# EAGLE design XMICRO-CF V1.0 (EAGLE 6.3)
PROJECT_NAME: XMICRO-CF; PROJECT_REVISION: 1.0

## Sheet 1 of 5: Bus Interface
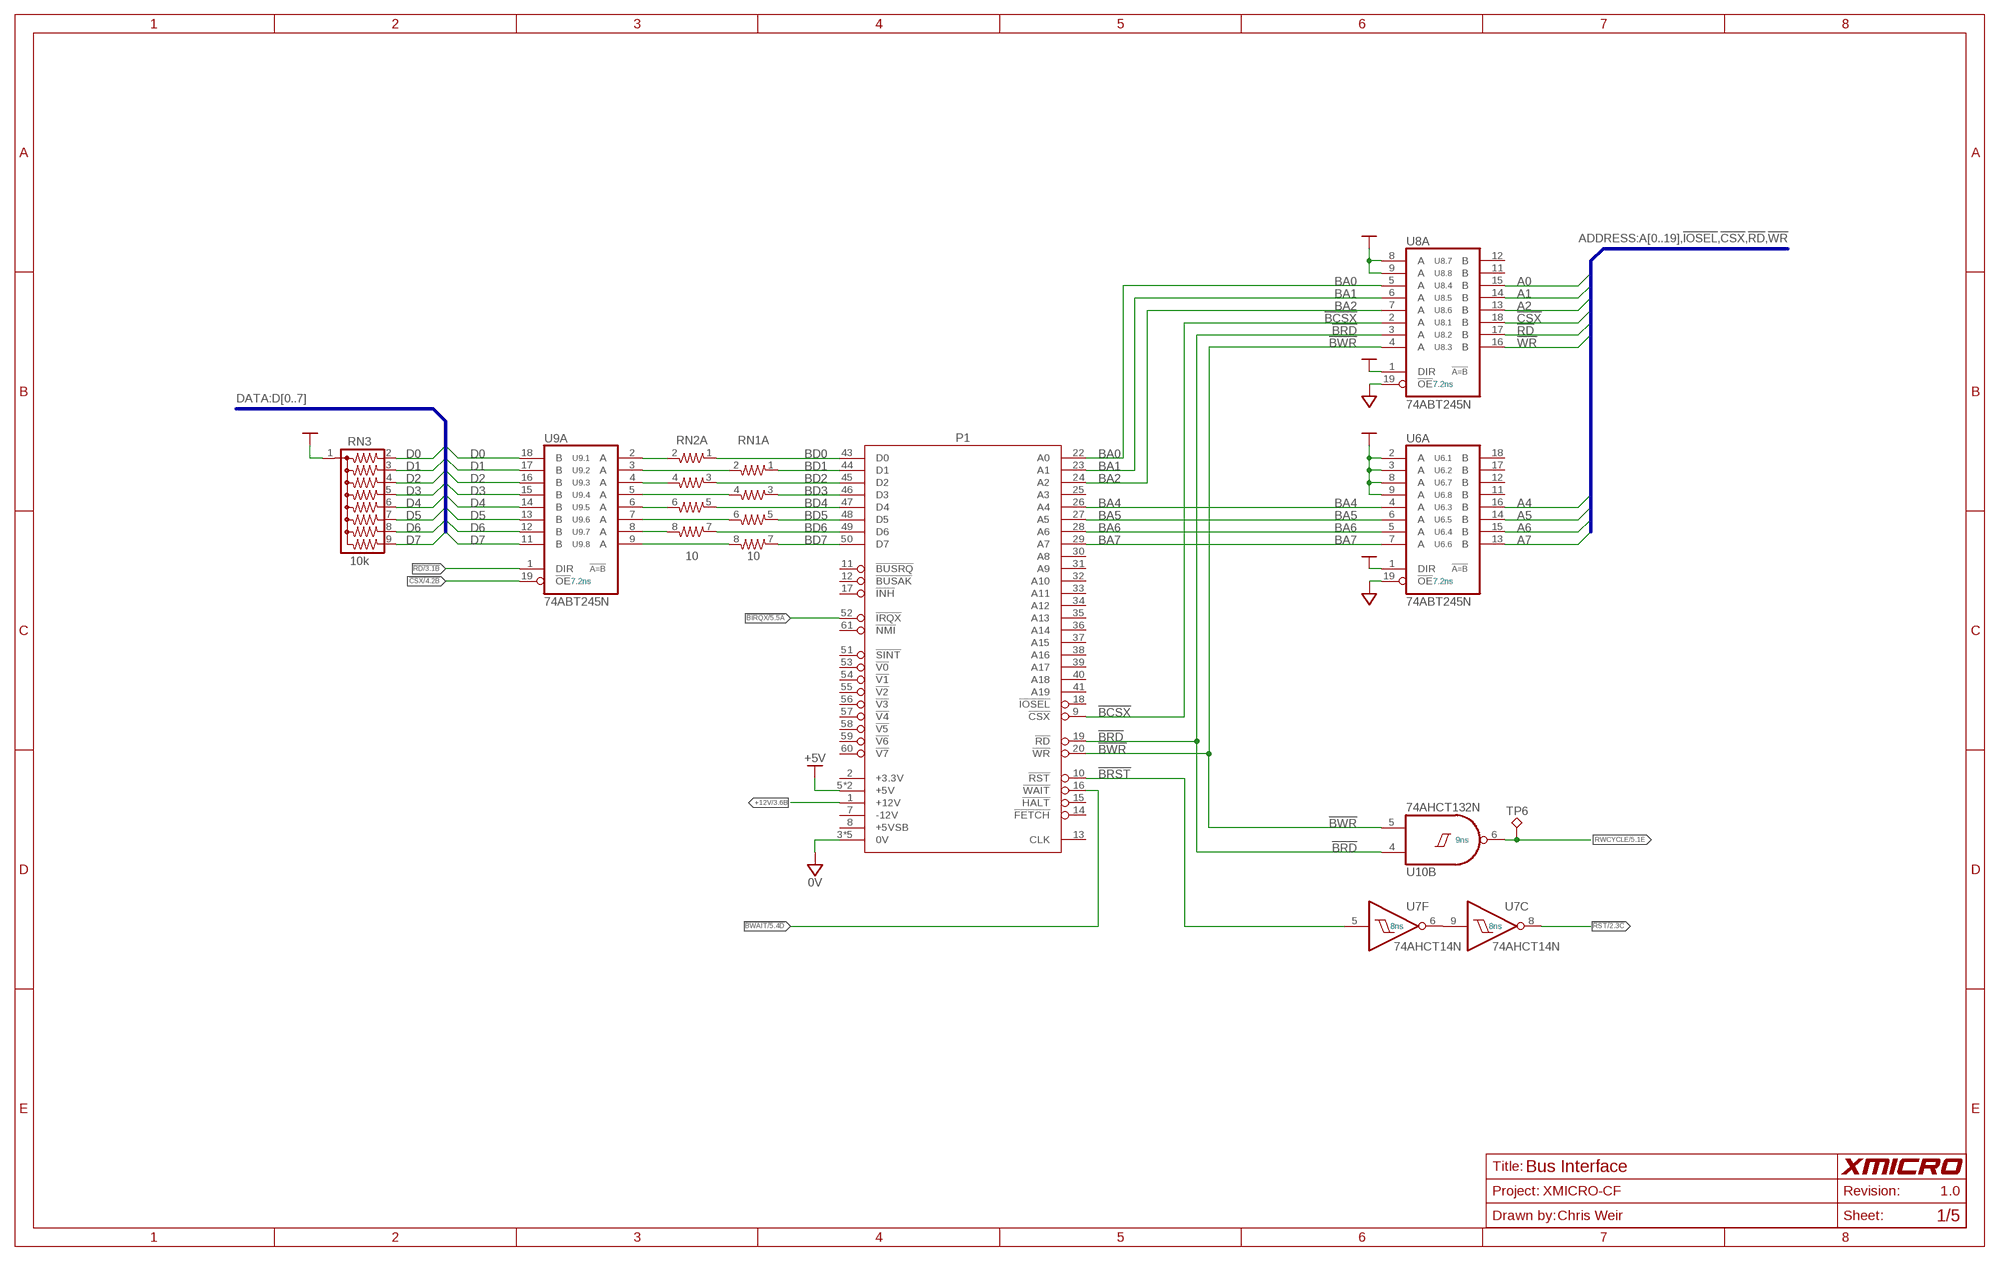
[diagram p0: schematic, sheet 1]
FRAME1 (11X17): DRAWN_BY: Chris Weir; SHEET_TITLE: Bus Interface

### Parts
P1  XMICRO-BUS-EDGE  [EDGE62M]
RN1  10  E4R  [SIL8]
RN2  10  E4R  [SIL8]
RN3  10k  G08R  [SIL9]
TP6  TP-040  [TP-040]
U6  74ABT245N  74ABT245-SN  [DIL20]
U7  74AHCT14N  [DIL14]
U8  74ABT245N  74ABT245-SN  [DIL20]
U9  74ABT245N  74ABT245-SN  [DIL20]
U10  74AHCT132N  [DIL14]

### Nets
0V [0V]: P1.3(0V) P1.4(0V) P1.21(0V) P1.42(0V) P1.62(0V) U6.19(A:!OE) U8.19(A:!OE) ; also sheet 2,3,4,5
!BCSX: P1.9(!CSX) U8.2(.1:A)
!BIRQX: P1.52(!IRQX) ; also sheet 5
!BRD: P1.19(!RD) U8.3(.2:A) U10.4(B:I0)
!BRST: P1.10(!RST) U7.5(F:I)
!BWAIT: P1.16(!WAIT) ; also sheet 5
!BWR: P1.20(!WR) U8.4(.3:A) U10.5(B:I1)
!CSX: U8.18(.1:B) U9.19(A:!OE) ; also sheet 4,5
!RD: U8.17(.2:B) U9.1(A:DIR) ; also sheet 2,3,4
!RST: U7.8(C:O) ; also sheet 2,5
!WR: U8.16(.3:B) ; also sheet 2,3,4
+5V [SUPPLY]: P1.5(+5V) P1.6(+5V) RN3.1 U6.1(A:DIR) U6.2(.1:A) U6.3(.2:A) U6.8(.7:A) U6.9(.8:A) U8.1(A:DIR) U8.8(.7:A) U8.9(.8:A) ; also sheet 2,3,4,5
+12V [SUPPLY]: P1.1(+12V) ; also sheet 3
A0: U8.15(.4:B) ; also sheet 2,3,4
A1: U8.14(.5:B) ; also sheet 2
A2: U8.13(.6:B) ; also sheet 2
A4: U6.16(.3:B) ; also sheet 4
A5: U6.14(.5:B) ; also sheet 4
A6: U6.15(.4:B) ; also sheet 4
A7: U6.13(.6:B) ; also sheet 4
BA0: P1.22(A0) U8.5(.4:A)
BA1: P1.23(A1) U8.6(.5:A)
BA2: P1.24(A2) U8.7(.6:A)
BA4: P1.26(A4) U6.4(.3:A)
BA5: P1.27(A5) U6.6(.5:A)
BA6: P1.28(A6) U6.5(.4:A)
BA7: P1.29(A7) U6.7(.6:A)
BD0: P1.43(D0) RN2.1
BD1: P1.44(D1) RN1.1
BD2: P1.45(D2) RN2.3
BD3: P1.46(D3) RN1.3
BD4: P1.47(D4) RN2.5
BD5: P1.48(D5) RN1.5
BD6: P1.49(D6) RN2.7
BD7: P1.50(D7) RN1.7
D0: RN3.2 U9.18(.1:B) ; also sheet 2,3,4
D1: RN3.3 U9.17(.2:B) ; also sheet 2,3,4
D2: RN3.4 U9.16(.3:B) ; also sheet 2,3,4
D3: RN3.5 U9.15(.4:B) ; also sheet 2,3,4,5
D4: RN3.6 U9.14(.5:B) ; also sheet 2,3,4
D5: RN3.7 U9.13(.6:B) ; also sheet 2,3,4
D6: RN3.8 U9.12(.7:B) ; also sheet 2,3,4
D7: RN3.9 U9.11(.8:B) ; also sheet 2,3,4
N$12: U7.6(F:O) U7.9(C:I)
N$37: RN2.2 U9.2(.1:A)
N$38: RN1.2 U9.3(.2:A)
N$39: RN2.4 U9.4(.3:A)
N$40: RN1.4 U9.5(.4:A)
N$41: RN2.6 U9.6(.5:A)
N$42: RN1.6 U9.7(.6:A)
N$43: RN2.8 U9.8(.7:A)
N$44: RN1.8 U9.9(.8:A)
RWCYCLE: TP6.1 U10.6(B:O) ; also sheet 5
Unconnected: P1.2(+3.3V) P1.7(-12V) P1.8(+5VSB) P1.11(!BUSRQ) P1.12(!BUSAK) P1.13(CLK) P1.14(!FETCH) P1.15(!HALT) P1.17(!INH) P1.18(!IOSEL) P1.25(A3) P1.30(A8) P1.31(A9) P1.32(A10) P1.33(A11) P1.34(A12) P1.35(A13) P1.36(A14) P1.37(A15) P1.38(A16) P1.39(A17) P1.40(A18) P1.41(A19) P1.51(!SINT) P1.53(!V0) P1.54(!V1) P1.55(!V2) P1.56(!V3) P1.57(!V4) P1.58(!V5) P1.59(!V6) P1.60(!V7) P1.61(!NMI) U6.11(.8:B) U6.12(.7:B) U6.17(.2:B) U6.18(.1:B) U8.11(.8:B) U8.12(.7:B)

### Buses
ADDRESS:A[0..19],!IOSEL,!CSX,!RD,!WR
DATA:D[0..7]

## Sheet 2 of 5: CompactFlash Interface
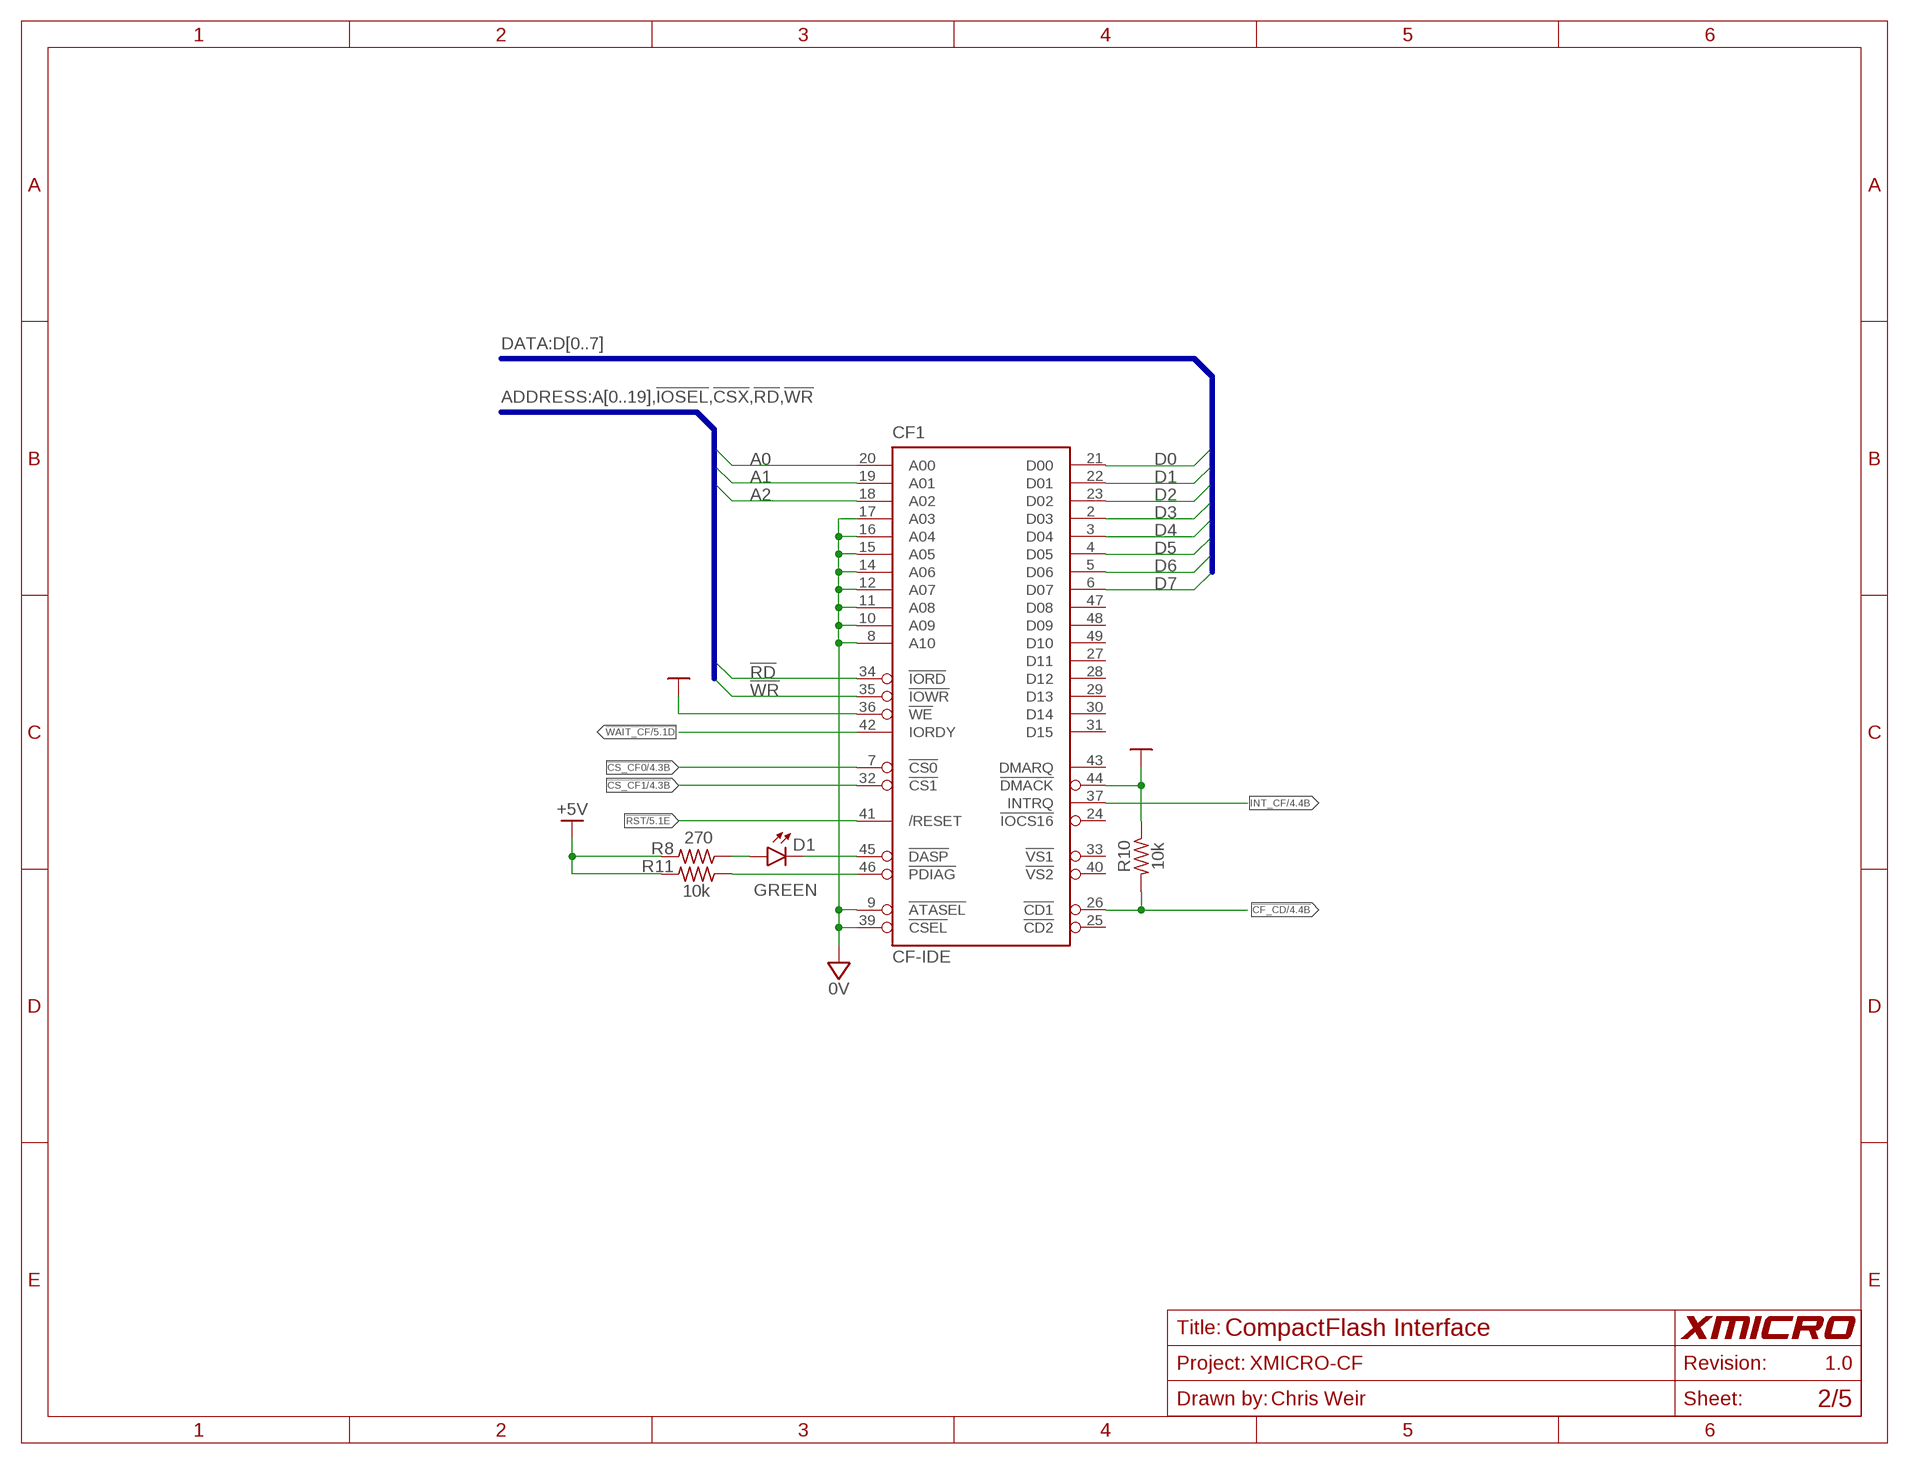
[diagram p1: schematic, sheet 2]
FRAME4 (LETTER): DRAWN_BY: Chris Weir; SHEET_TITLE: CompactFlash Interface

### Parts
CF1  CF-IDE  [CF-KYOCERA]
D1  GREEN  LED3MM-R  [LED-3R]
R8  270  R-US_0207/10  [0207/10]
R10  10k  R-US_0207/10  [0207/10]
R11  10k  R-US_0207/10  [0207/10]

### Nets
0V [0V]: CF1.8(A10) CF1.9(!ATASEL) CF1.10(A09) CF1.11(A08) CF1.12(A07) CF1.14(A06) CF1.15(A05) CF1.16(A04) CF1.17(A03) CF1.39(!CSEL) ; also sheet 1,3,4,5
!CF_CD: CF1.26(!CD1) R10.2 ; also sheet 4
!CS_CF0: CF1.7(!CS0) ; also sheet 4
!CS_CF1: CF1.32(!CS1) ; also sheet 4
!RD: CF1.34(!IORD) ; also sheet 1,3,4
!RST: CF1.41(/RESET) ; also sheet 1,5
!WAIT_CF: CF1.42(IORDY) ; also sheet 5
!WR: CF1.35(!IOWR) ; also sheet 1,3,4
+5V [SUPPLY]: CF1.36(!WE) CF1.44(!DMACK) R8.2 R10.1 R11.2 ; also sheet 1,3,4,5
A0: CF1.20(A00) ; also sheet 1,3,4
A1: CF1.19(A01) ; also sheet 1
A2: CF1.18(A02) ; also sheet 1
D0: CF1.21(D00) ; also sheet 1,3,4
D1: CF1.22(D01) ; also sheet 1,3,4
D2: CF1.23(D02) ; also sheet 1,3,4
D3: CF1.2(D03) ; also sheet 1,3,4,5
D4: CF1.3(D04) ; also sheet 1,3,4
D5: CF1.4(D05) ; also sheet 1,3,4
D6: CF1.5(D06) ; also sheet 1,3,4
D7: CF1.6(D07) ; also sheet 1,3,4
INT_CF: CF1.37(INTRQ) ; also sheet 4,5
N$1: CF1.45(!DASP) D1.C
N$2: D1.A R8.1
N$25: CF1.46(!PDIAG) R11.1
Unconnected: CF1.24(!IOCS16) CF1.25(!CD2) CF1.27(D11) CF1.28(D12) CF1.29(D13) CF1.30(D14) CF1.31(D15) CF1.33(!VS1) CF1.40(!VS2) CF1.43(DMARQ) CF1.47(D08) CF1.48(D09) CF1.49(D10)

### Buses
ADDRESS:A[0..19],!IOSEL,!CSX,!RD,!WR
DATA:D[0..7]

## Sheet 3 of 5: Real-time Clock
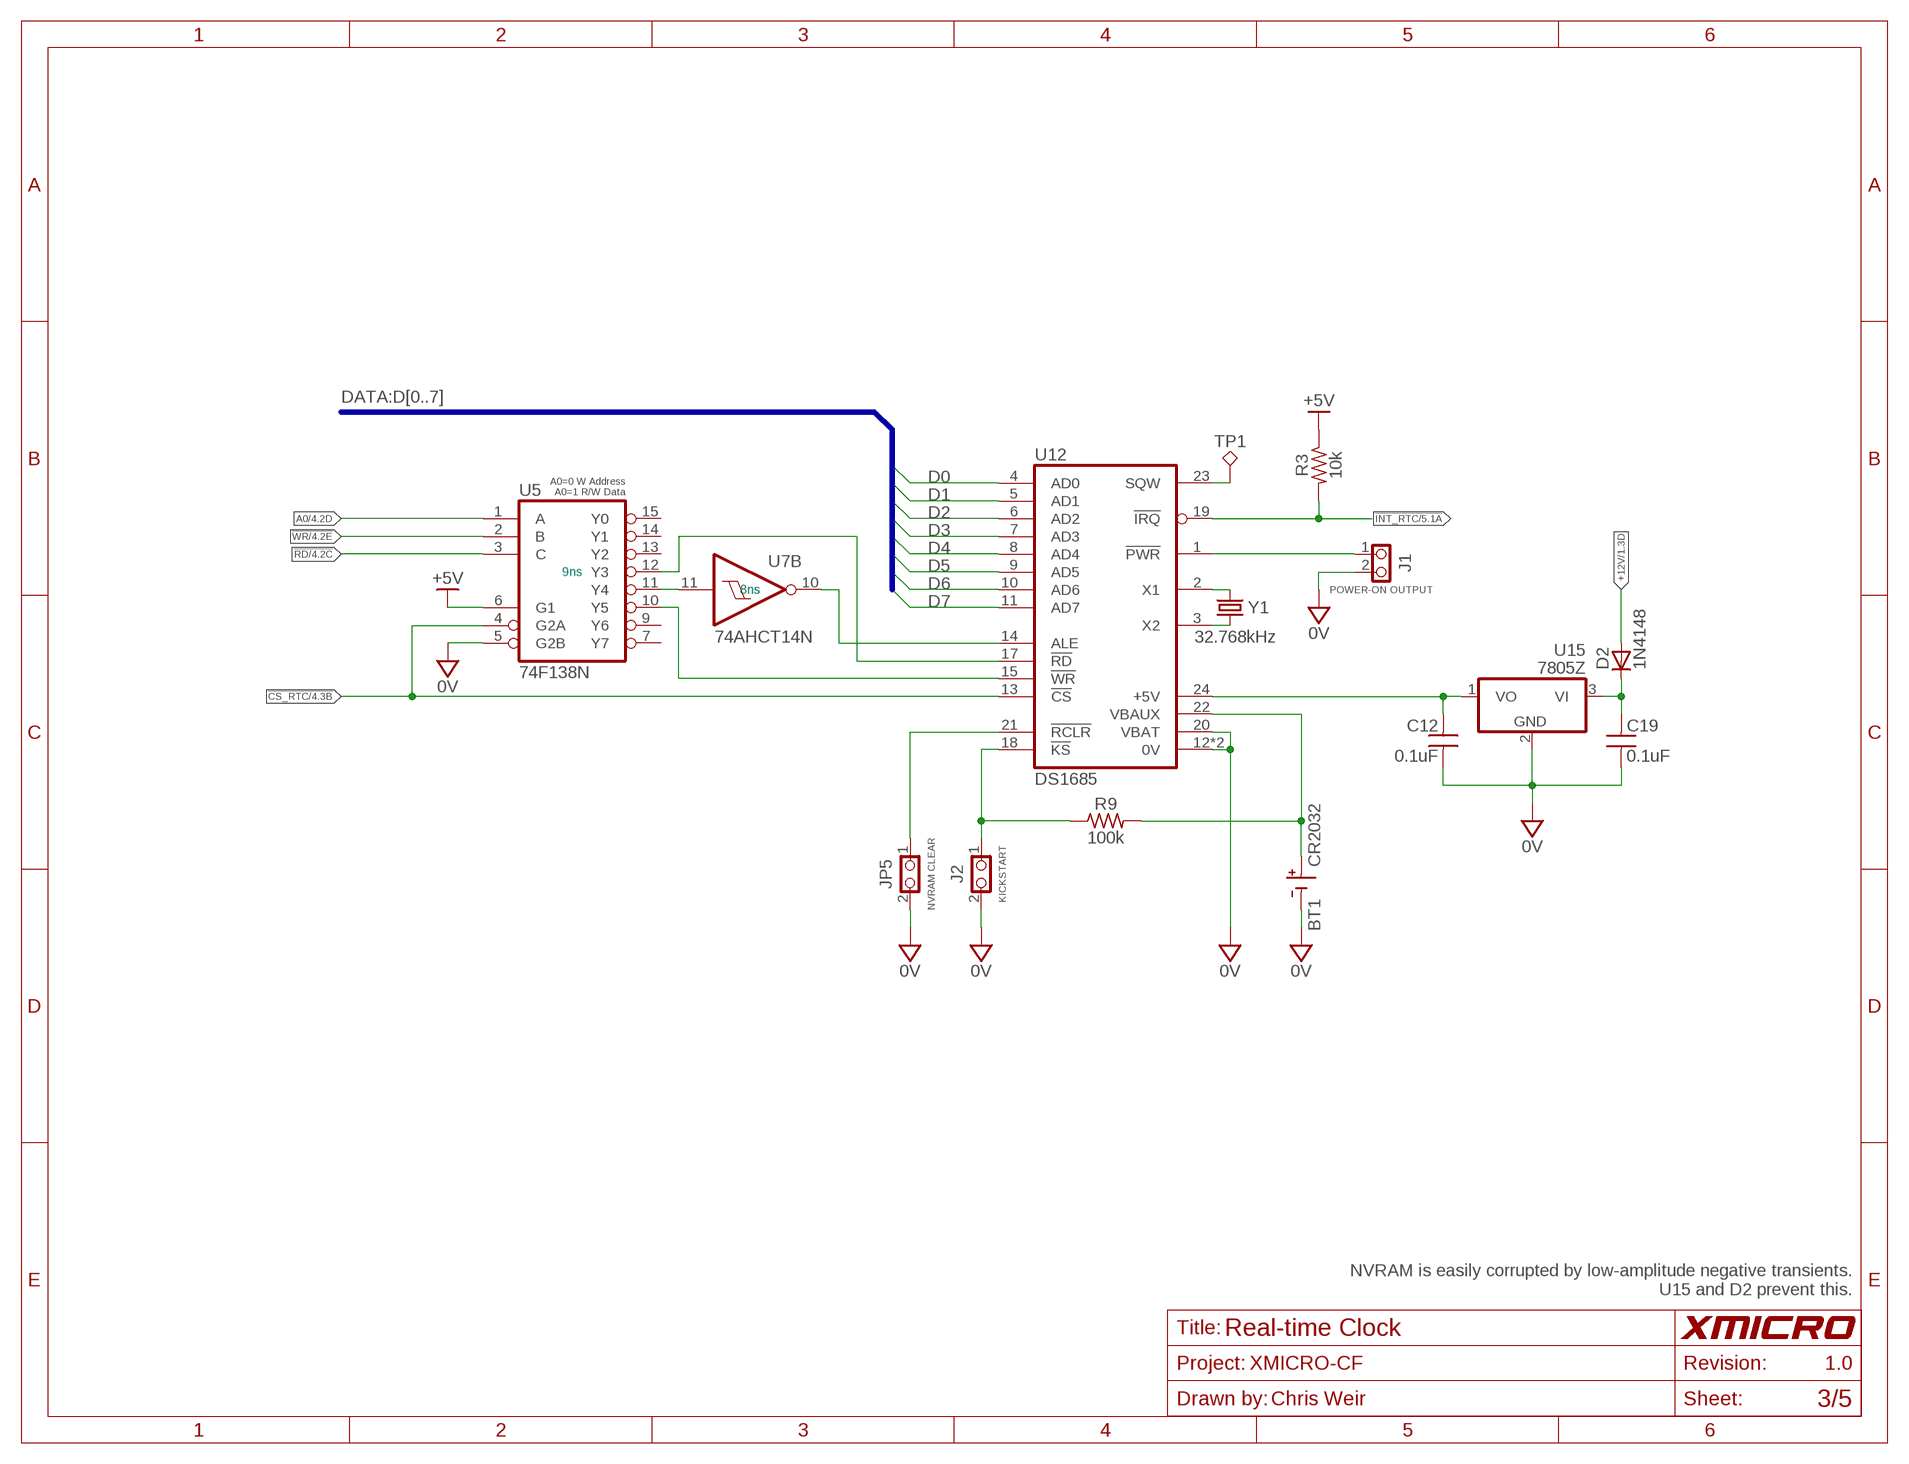
[diagram p2: schematic, sheet 3]
FRAME5 (LETTER): DRAWN_BY: Chris Weir; SHEET_TITLE: Real-time Clock

### Parts
BT1  CR2032  CR2032TH  [BU2032]
C12  0.1uF  C-US025-024X044  [C025-024X044]
C19  0.1uF  C-US025-024X044  [C025-024X044]
D2  1N4148  1N4148DO35-7  [DO35-7]
J1  1X2  [1X2]
J2  1X2-THRU  [1X2]
JP5  1X2-THRU  [1X2]
R3  10k  R-US_0207/10  [0207/10]
R9  100k  R-US_0207/10  [0207/10]
TP1  TP-040  [TP-040]
U5  74F138N  [DIL16]
U12  DS1685  [DIL24]
U15  7805Z  [TO92]
Y1  32.768kHz  CRYSTAL-3X8  [CRYSTAL-3X8N]

### Nets
0V [0V]: BT1.N(-) C12.2 C19.2 J1.2 J2.2 JP5.2 U5.5(G2B) U12.12(0V) U12.16(0V) U12.20(VBAT) U15.2(0V) ; also sheet 1,2,4,5
!CS_RTC: U5.4(G2A) U12.13(!CS) ; also sheet 4
!INT_RTC: R3.2 U12.19(!IRQ) ; also sheet 5
!RD: U5.3(C) ; also sheet 1,2,4
!WR: U5.2(B) ; also sheet 1,2,4
+5V [SUPPLY]: R3.1 U5.6(G1) ; also sheet 1,2,4,5
+12V [SUPPLY]: D2.A ; also sheet 1
A0: U5.1(A) ; also sheet 1,2,4
D0: U12.4(AD0) ; also sheet 1,2,4
D1: U12.5(AD1) ; also sheet 1,2,4
D2: U12.6(AD2) ; also sheet 1,2,4
D3: U12.7(AD3) ; also sheet 1,2,4,5
D4: U12.8(AD4) ; also sheet 1,2,4
D5: U12.9(AD5) ; also sheet 1,2,4
D6: U12.10(AD6) ; also sheet 1,2,4
D7: U12.11(AD7) ; also sheet 1,2,4
N$4: JP5.1 U12.21(!RCLR)
N$7: TP1.1 U12.23(SQW)
N$8: U12.2(X1) Y1.2
N$10: U12.3(X2) Y1.1
N$11: U5.10(Y5) U12.15(!WR)
N$13: U5.11(Y4) U7.11(B:I)
N$14: U5.12(Y3) U12.17(!RD)
N$17 [SUPPLY]: C12.1 U12.24(+5V) U15.1(VO)
N$18: U7.10(B:O) U12.14(ALE)
N$19: J1.1 U12.1(!PWR)
N$20: J2.1 R9.1 U12.18(!KS)
N$21 [SUPPLY]: C19.1 D2.C U15.3(VI)
N$24: BT1.P1(+) BT1.P2(+) R9.2 U12.22(VBAUX)
Unconnected: U5.7(Y7) U5.9(Y6) U5.13(Y2) U5.14(Y1) U5.15(Y0)

### Buses
DATA:D[0..7]

### Notes on the sheet
- A0=0 W Address
  A0=1 R/W Data
- POWER-ON OUTPUT
- NVRAM CLEAR | KICKSTART
- NVRAM is easily corrupted by low-amplitude negative transients.
  U15 and D2 prevent this.

## Sheet 4 of 5: Chip Selects/Onboard Registers
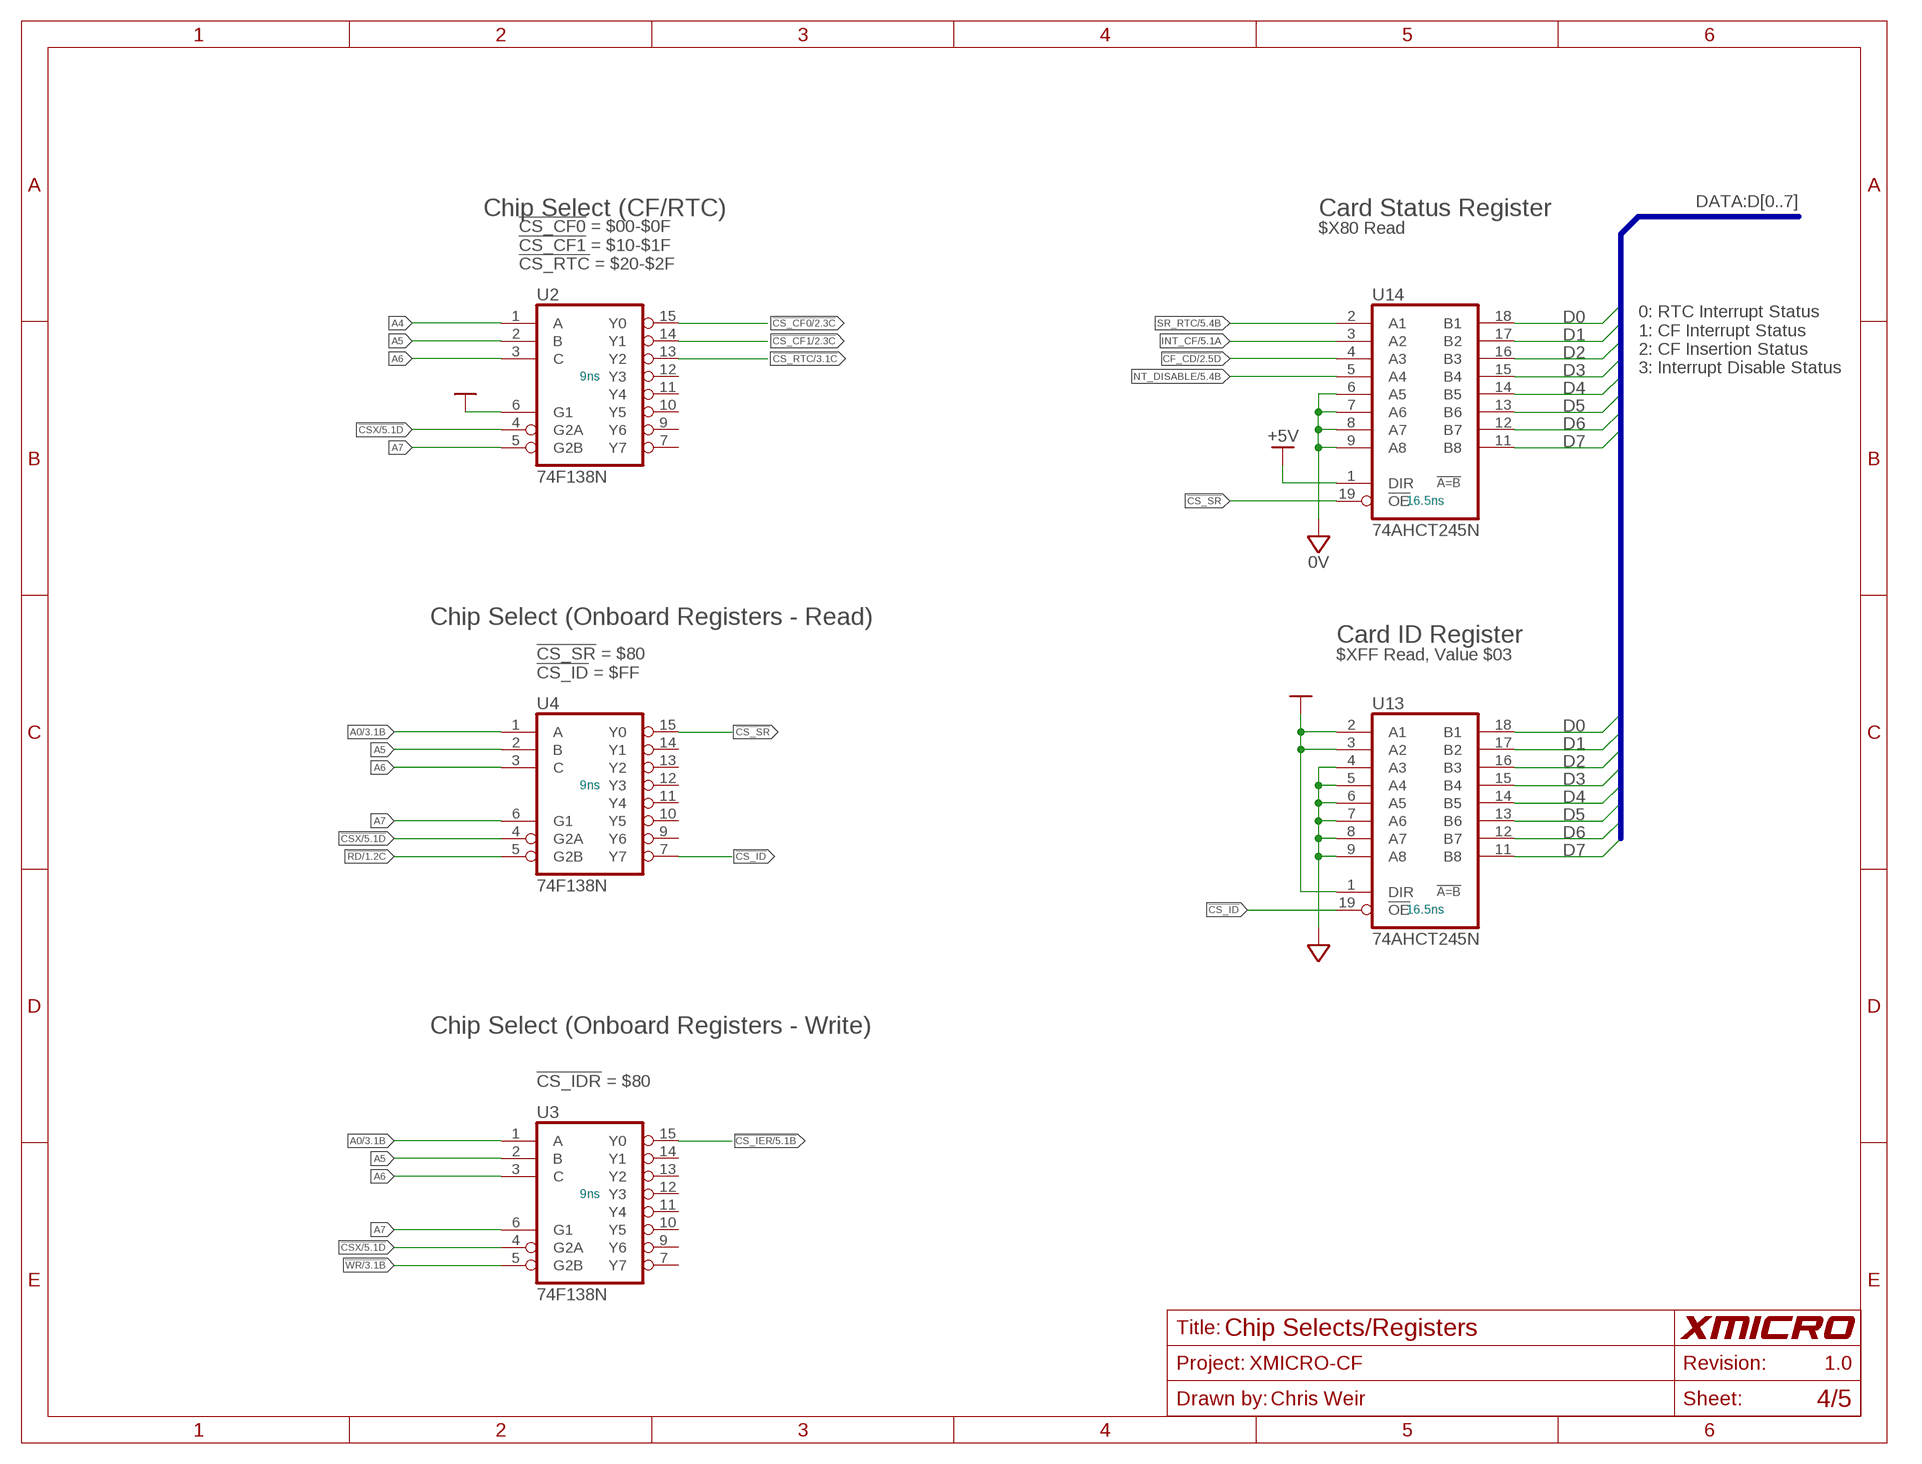
[diagram p3: schematic, sheet 4]
FRAME6 (LETTER): DRAWN_BY: Chris Weir; SHEET_TITLE: Chip Selects/Registers

### Parts
U2  74F138N  [DIL16]
U3  74F138N  [DIL16]
U4  74F138N  [DIL16]
U13  74AHCT245N  [DIL20]
U14  74AHCT245N  [DIL20]

### Nets
0V [0V]: U13.4(A3) U13.5(A4) U13.6(A5) U13.7(A6) U13.8(A7) U13.9(A8) U14.6(A5) U14.7(A6) U14.8(A7) U14.9(A8) ; also sheet 1,2,3,5
!CF_CD: U14.4(A3) ; also sheet 2
!CS_CF0: U2.15(Y0) ; also sheet 2
!CS_CF1: U2.14(Y1) ; also sheet 2
!CS_ID: U4.7(Y7) U13.19(!OE)
!CS_IER: U3.15(Y0) ; also sheet 5
!CS_RTC: U2.13(Y2) ; also sheet 3
!CS_SR: U4.15(Y0) U14.19(!OE)
!CSX: U2.4(G2A) U3.4(G2A) U4.4(G2A) ; also sheet 1,5
!RD: U4.5(G2B) ; also sheet 1,2,3
!WR: U3.5(G2B) ; also sheet 1,2,3
+5V [SUPPLY]: U2.6(G1) U13.1(DIR) U13.2(A1) U13.3(A2) U14.1(DIR) ; also sheet 1,2,3,5
A0: U3.1(A) U4.1(A) ; also sheet 1,2,3
A4: U2.1(A) ; also sheet 1
A5: U2.2(B) U3.2(B) U4.2(B) ; also sheet 1
A6: U2.3(C) U3.3(C) U4.3(C) ; also sheet 1
A7: U2.5(G2B) U3.6(G1) U4.6(G1) ; also sheet 1
D0: U13.18(B1) U14.18(B1) ; also sheet 1,2,3
D1: U13.17(B2) U14.17(B2) ; also sheet 1,2,3
D2: U13.16(B3) U14.16(B3) ; also sheet 1,2,3
D3: U13.15(B4) U14.15(B4) ; also sheet 1,2,3,5
D4: U13.14(B5) U14.14(B5) ; also sheet 1,2,3
D5: U13.13(B6) U14.13(B6) ; also sheet 1,2,3
D6: U13.12(B7) U14.12(B7) ; also sheet 1,2,3
D7: U13.11(B8) U14.11(B8) ; also sheet 1,2,3
INT_CF: U14.3(A2) ; also sheet 2,5
INT_DISABLE: U14.5(A4) ; also sheet 5
SR_RTC: U14.2(A1) ; also sheet 5
Unconnected: U2.7(Y7) U2.9(Y6) U2.10(Y5) U2.11(Y4) U2.12(Y3) U3.7(Y7) U3.9(Y6) U3.10(Y5) U3.11(Y4) U3.12(Y3) U3.13(Y2) U3.14(Y1) U4.9(Y6) U4.10(Y5) U4.11(Y4) U4.12(Y3) U4.13(Y2) U4.14(Y1)

### Buses
DATA:D[0..7]

### Notes on the sheet
- Chip Select (CF/RTC) | Card Status Register
- $X80 Read
- !CS_CF0! = $00-$0F
  !CS_CF1! = $10-$1F
  !CS_RTC! = $20-$2F
- 0: RTC Interrupt Status
  1: CF Interrupt Status
  2: CF Insertion Status
  3: Interrupt Disable Status
- Chip Select (Onboard Registers - Read)
- Card ID Register
- $XFF Read, Value $03
- !CS_SR! = $80
  !CS_ID! = $FF
- Chip Select (Onboard Registers - Write)
- !CS_IDR! = $80

## Sheet 5 of 5: Interrupt Combiner/Misc.
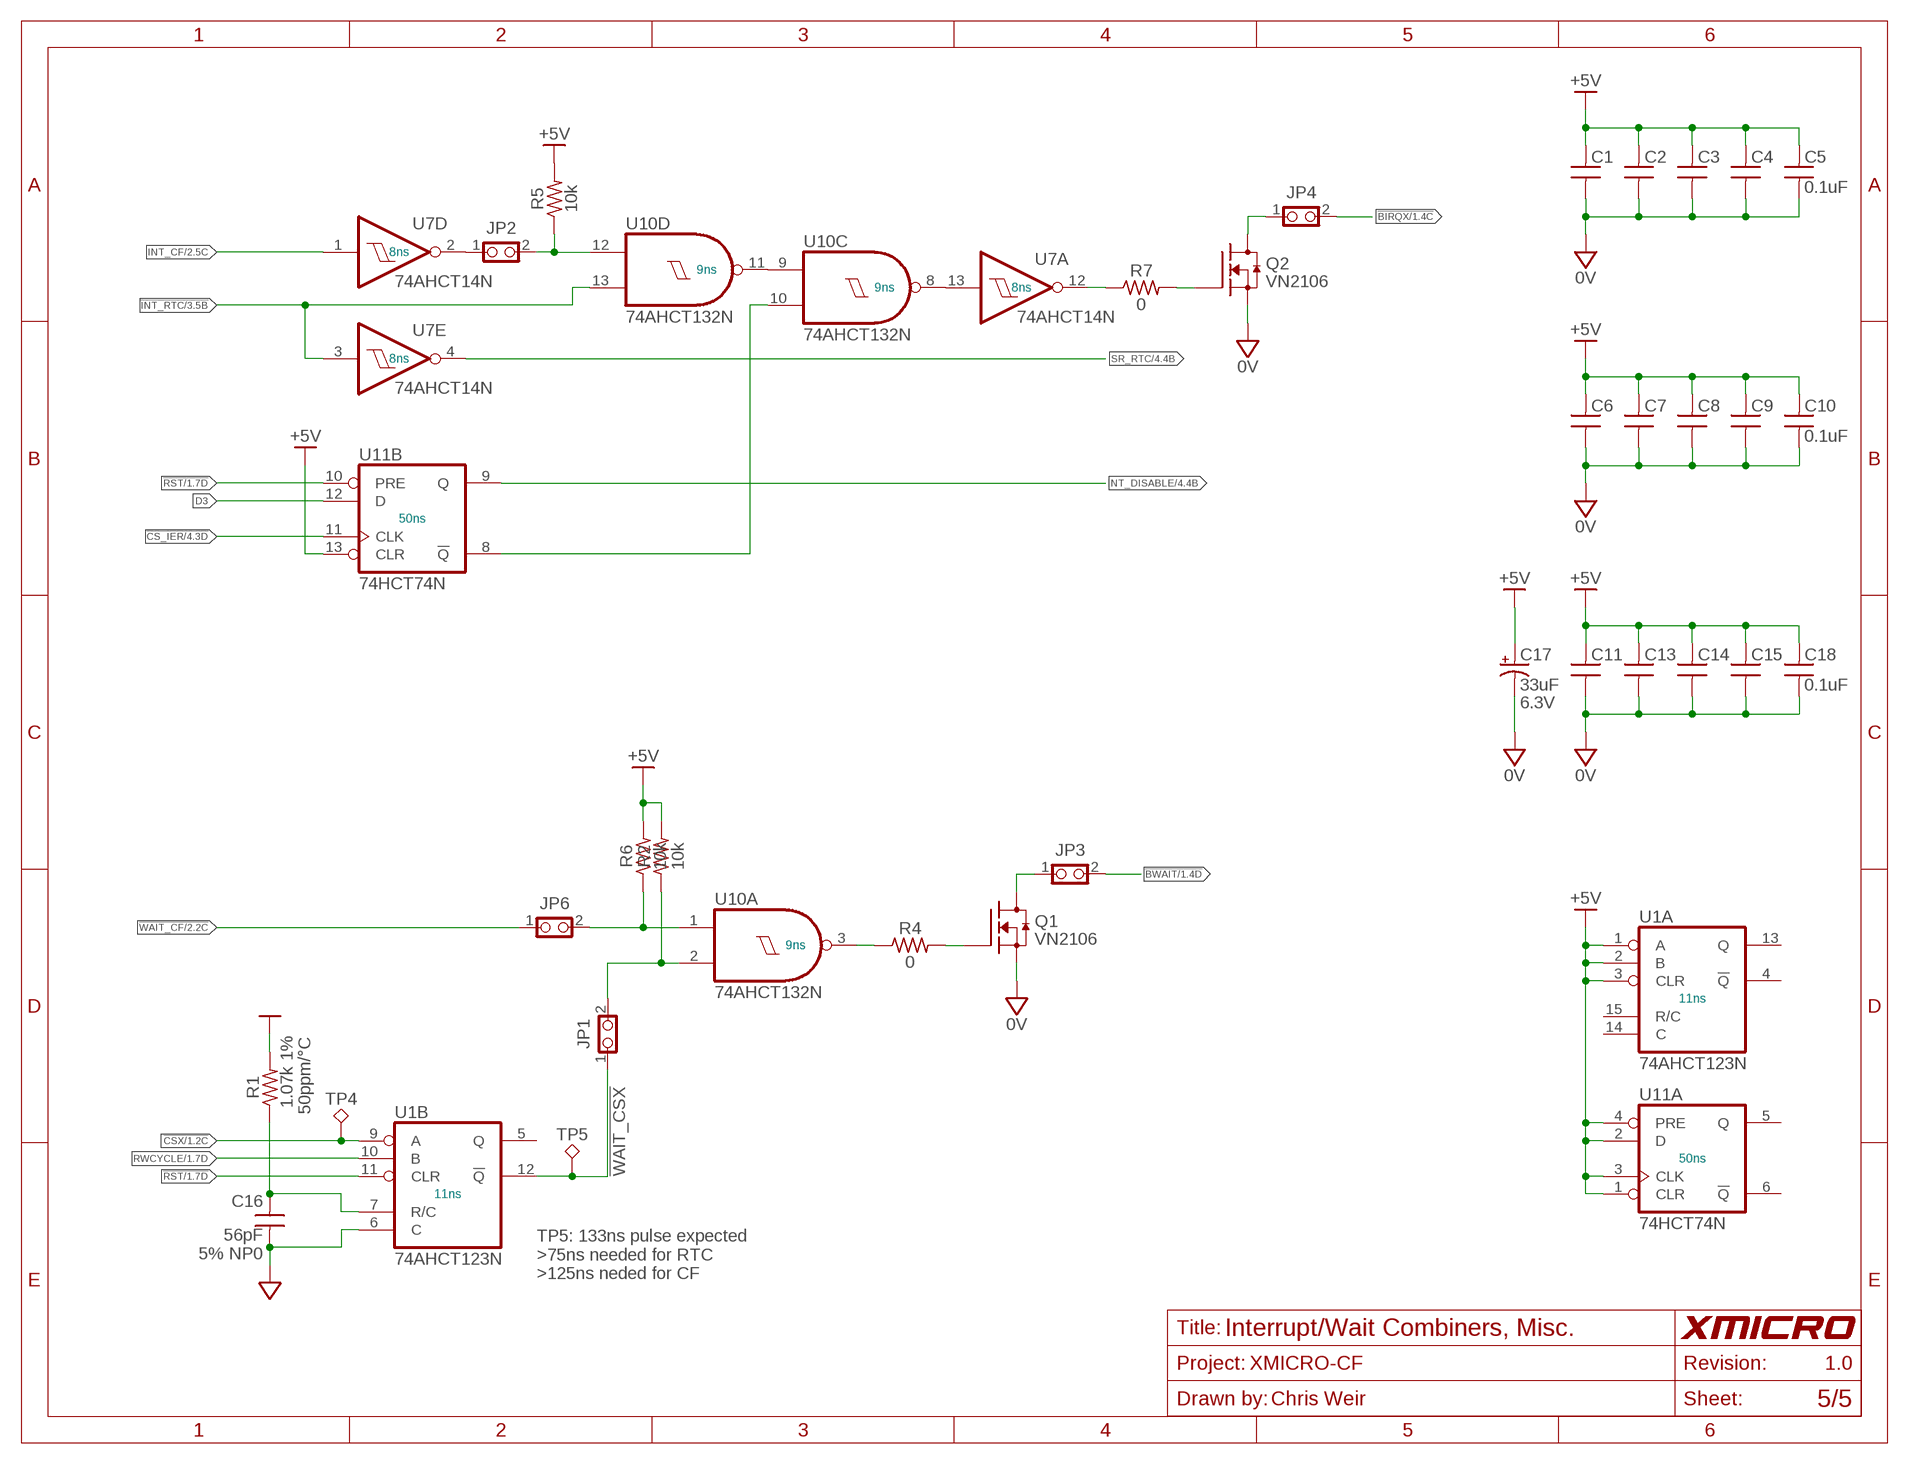
[diagram p4: schematic, sheet 5]
FRAME7 (LETTER): DRAWN_BY: Chris Weir; SHEET_TITLE: Interrupt/Wait Combiners, Misc.

### Parts
C1  0.1uF  C-US025-024X044  [C025-024X044]
C2  0.1uF  C-US025-024X044  [C025-024X044]
C3  0.1uF  C-US025-024X044  [C025-024X044]
C4  0.1uF  C-US025-024X044  [C025-024X044]
C5  0.1uF  C-US025-024X044  [C025-024X044]
C6  0.1uF  C-US025-024X044  [C025-024X044]
C7  0.1uF  C-US025-024X044  [C025-024X044]
C8  0.1uF  C-US025-024X044  [C025-024X044]
C9  0.1uF  C-US025-024X044  [C025-024X044]
C10  0.1uF  C-US025-024X044  [C025-024X044]
C11  0.1uF  C-US025-024X044  [C025-024X044]
C13  0.1uF  C-US025-024X044  [C025-024X044]
C14  0.1uF  C-US025-024X044  [C025-024X044]
C15  0.1uF  C-US025-024X044  [C025-024X044]
C16  56pF  C-US025-024X044  [C025-024X044]
C17  33uF  CPOL-USE2.5-6  [E2,5-6]
C18  0.1uF  C-US025-024X044  [C025-024X044]
JP1  1X2-THRU  [1X2]
JP2  1X2-THRU  [1X2]
JP3  1X2-THRU  [1X2]
JP4  1X2-THRU  [1X2]
JP6  1X2-THRU  [1X2]
Q1  VN2106  [TO92]
Q2  VN2106  [TO92]
R1  1.07k  R-US_0207/10  [0207/10]
R2  10k  R-US_0207/10  [0207/10]
R4  0  R-US_0207/10  [0207/10]
R5  10k  R-US_0207/10  [0207/10]
R6  10k  R-US_0207/10  [0207/10]
R7  0  R-US_0207/12  [0207/12]
TP4  TP-040  [TP-040]
TP5  TP-040  [TP-040]
U1  74AHCT123N  [DIL16]
U11  74HCT74N  [DIL14]

### Nets
0V [0V]: C1.2 C2.2 C3.2 C4.2 C5.2 C6.2 C7.2 C8.2 C9.2 C10.2 C11.2 C13.2 C14.2 C15.2 C16.2 C17.- C18.2 Q1.1(S) Q2.1(S) U1.6(B:C) ; also sheet 1,2,3,4
!BIRQX: JP4.2 ; also sheet 1
!BWAIT: JP3.2 ; also sheet 1
!CS_IER: U11.11(B:CLK) ; also sheet 4
!CSX: TP4.1 U1.9(B:A) ; also sheet 1,4
!INT_RTC: U7.3(E:I) U10.13(D:I1) ; also sheet 3
!RST: U1.11(B:CLR) U11.10(B:PRE) ; also sheet 1,2
!WAIT_CF: JP6.1 ; also sheet 2
!WAIT_CSX: JP1.1 TP5.1 U1.12(B:!Q)
+5V [SUPPLY]: C1.1 C2.1 C3.1 C4.1 C5.1 C6.1 C7.1 C8.1 C9.1 C10.1 C11.1 C13.1 C14.1 C15.1 C17.+ C18.1 R1.2 R2.2 R5.2 R6.2 U1.1(A:A) U1.2(A:B) U1.3(A:CLR) U11.1(A:CLR) U11.2(A:D) U11.3(A:CLK) U11.4(A:PRE) U11.13(B:CLR) ; also sheet 1,2,3,4
D3: U11.12(B:D) ; also sheet 1,2,3,4
INT_CF: U7.1(D:I) ; also sheet 2,4
INT_DISABLE: U11.9(B:Q) ; also sheet 4
N$3: U7.13(A:I) U10.8(C:O)
N$5: JP2.1 U7.2(D:O)
N$6: Q1.2(G) R4.2
N$9: JP3.1 Q1.3(D)
N$15: JP6.2 R6.1 U10.1(A:I0)
N$22: Q2.2(G) R7.2
N$23: JP4.1 Q2.3(D)
N$26: U10.10(C:I1) U11.8(B:!Q)
N$29: C16.1 R1.1 U1.7(B:R/C)
N$30: JP1.2 R2.1 U10.2(A:I1)
N$34: U10.9(C:I0) U10.11(D:O)
N$36: JP2.2 R5.1 U10.12(D:I0)
N$46: R4.1 U10.3(A:O)
N$47: R7.1 U7.12(A:O)
RWCYCLE: U1.10(B:B) ; also sheet 1
SR_RTC: U7.4(E:O) ; also sheet 4
Unconnected: U1.4(A:!Q) U1.5(B:Q) U1.13(A:Q) U1.14(A:C) U1.15(A:R/C) U11.5(A:Q) U11.6(A:!Q)

### Notes on the sheet
- TP5: 133ns pulse expected
  >75ns needed for RTC
  >125ns neded for CF

## Power pins joined to a net without a drawn wire
0V: CF1.1(0V) CF1.50(0V) CF1.M1(0V) CF1.M2(0V) U1.8(P:0V) U2.8(0V) U3.8(0V) U4.8(0V) U5.8(0V) U6.10(P:0V) U7.7(P:0V) U8.10(P:0V) U9.10(P:0V) U10.7(P:0V) U11.7(P:0V) U13.10(0V) U14.10(0V)
+5V: CF1.13(+5V) CF1.38(+5V) U1.16(P:+5V) U2.16(+5V) U3.16(+5V) U4.16(+5V) U5.16(+5V) U6.20(P:+5V) U7.14(P:+5V) U8.20(P:+5V) U9.20(P:+5V) U10.14(P:+5V) U11.14(P:+5V) U13.20(+5V) U14.20(+5V)

## Library data of the parts
BT1 = connector-misc:CR2032
C1-C15 C18 C19 = rcl:C-US: CAPACITOR, American symbol
C16 = rcl:C-US: CAPACITOR, American symbol; TC: NP0; TOLERANCE: 5%
C17 = rcl:CPOL-US: POLARIZED CAPACITOR, American symbol; VOLTAGE: 6.3V
CF1 = ic-misc:CF-IDE
D1 = diode-led:LED: LED OSRAM: - CHIPLED LG R971, LG N971, LY N971, LG Q971, LY Q971, LO R971, LY R971LH N974, LH R974 LS Q976, LO Q976, LY Q976 LO Q996 - Hyper CHIPLED LW Q18S LB Q993, LB Q99A, LB R99A - SideLED LS A670, LO A670, LY A670, LG A670, LP A670 LB A673, LV A673, LT A673, LW A673 LH A674 LY A675 LS A676, LA A676, LO A676, LY A676, LW A676 LS A679, LY A679, LG A679 - Hyper Micro SIDELED® LS Y876, LA Y876, LO Y876, LY Y876 LT Y87S - SmartLED LW L88C, LW L88S LB L89C, LB L89S, LG L890 LS L89K, LO L89K, LY L89K LS L896, LA L896, LO L896, LY L896 - TOPLED LS T670, LO T670, LY T670, LG T670, LP T670 LSG T670, LSP T670, LSY T670, LOP T670, LYG T670 LG T671, LOG T671, LSG T671 LB T673, LV T673, LT T673, LW T673 LH T674 LS T676, LA T676, LO T676, LY T676, LB T676, LH T676, LSB T676, LW T676 LB T67C, LV T67C, LT T67C, LS T67K, LO T67K, LY T67K, LW E67C LS E67B, LA E67B, LO E67B, LY E67B, LB E67C, LV E67C, LT E67C LW T67C LS T679, LY T679, LG T679 LS T770, LO T770, LY T770, LG T770, LP T770 LB T773, LV T773, LT T773, LW T773 LH T774 LS E675, LA E675, LY E675, LS T675 LS T776, LA T776, LO T776, LY T776, LB T776 LHGB T686 LT T68C, LB T68C - Hyper Mini TOPLED® LB M676 - Mini TOPLED Santana® LG M470 LS M47K, LO M47K, LY M47K Source: http://www.osram.convergy.de LUXEON: - LUMILED® LXK2-PW12-R00, LXK2-PW12-S00, LXK2-PW14-U00, LXK2-PW14-V00 LXK2-PM12-R00, LXK2-PM12-S00, LXK2-PM14-U00 LXK2-PE12-Q00, LXK2-PE12-R00, LXK2-PE12-S00, LXK2-PE14-T00, LXK2-PE14-U00 LXK2-PB12-K00, LXK2-PB12-L00, LXK2-PB12-M00, LXK2-PB14-N00, LXK2-PB14-P00, LXK2-PB14-Q00 LXK2-PR12-L00, LXK2-PR12-M00, LXK2-PR14-Q00, LXK2-PR14-R00 LXK2-PD12-Q00, LXK2-PD12-R00, LXK2-PD12-S00 LXK2-PH12-R00, LXK2-PH12-S00 LXK2-PL12-P00, LXK2-PL12-Q00, LXK2-PL12-R00 Source: www.luxeon.com KINGBRIGHT: KA-3528ASYC Source: www.kingbright.com
D2 = diode:1N4148: DIODE high speed (Philips)
J1 = header:1X2: PIN HEADER
J2 JP1-JP6 = header:1X2-THRU
P1 = xmicro:XMICRO-BUS: XMICRO Bus Symbol with logical pin arrangement
Q1 Q2 = transistor-misc:VN2106
R1 = rcl:R-US_: RESISTOR, American symbol; TC: 50ppm/°C; TOLERANCE: 1%
R2-R11 = rcl:R-US_: RESISTOR, American symbol
RN1 RN2 = resistor-sil:E4R: SIL RESISTOR; OC_FARNELL: unknown; OC_NEWARK: unknown
RN3 = resistor-sil:G08R: SIL RESISTOR; OC_FARNELL: unknown; OC_NEWARK: unknown
TP1 TP4-TP6 = header:TP: Test Point
U1 = 74xx-us:74*123: Retriggerable monostable MULTIVIBRATOR; TPD: 11ns
U2-U5 = 74xx-us:74*138: 3-line to 8-line DECODER/DEMULTIPLEXER; TPD: 9ns
U6 U8 U9 = 74xx-us:74*245-S: Octal BUS TRANSCEIVER, 3-state; TPD: 7.2ns
U7 = 74xx-us:74*14: Hex schmitt trigger INVERTER; TPD: 8ns
U10 = 74xx-us:74*132: Quad 2-input NAND schmitt trigger; TPD: 9ns
U11 = 74xx-us:74*74: Dual D type positive edge triggered FLIP FLOP, preset and clear; TPD: 50ns
U12 = ic-misc:DS1685
U13 U14 = 74xx-us:74*245: Octal BUS TRANSCEIVER, 3-state; TPD: 16.5ns
U15 = ic-misc:78*
Y1 = crystal-misc:CRYSTAL

## Net classes
1 0V: clearance 0.305 mm
2 SUPPLY: clearance 0.305 mm
3 CHASSIS: clearance 0.762 mm

## Board
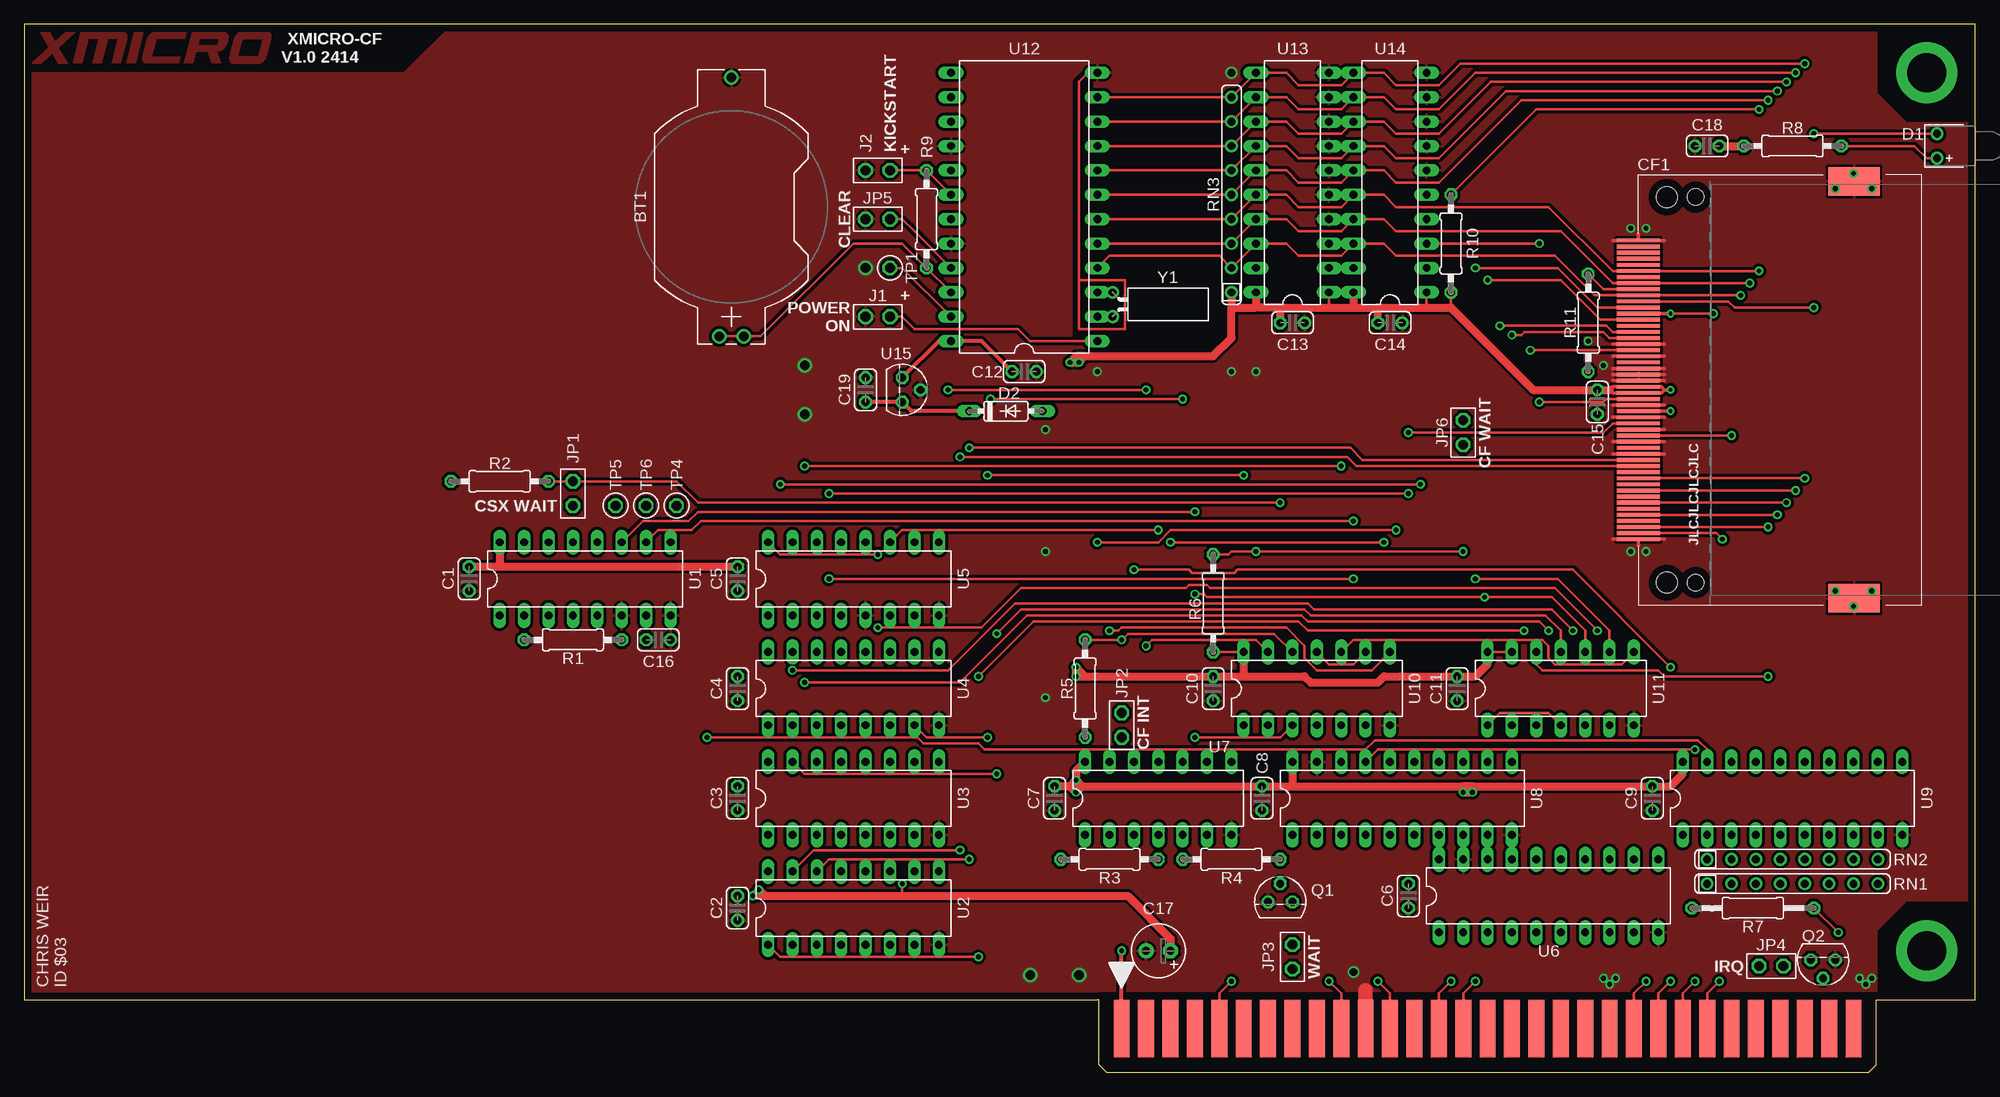
[diagram p5: board, top side]
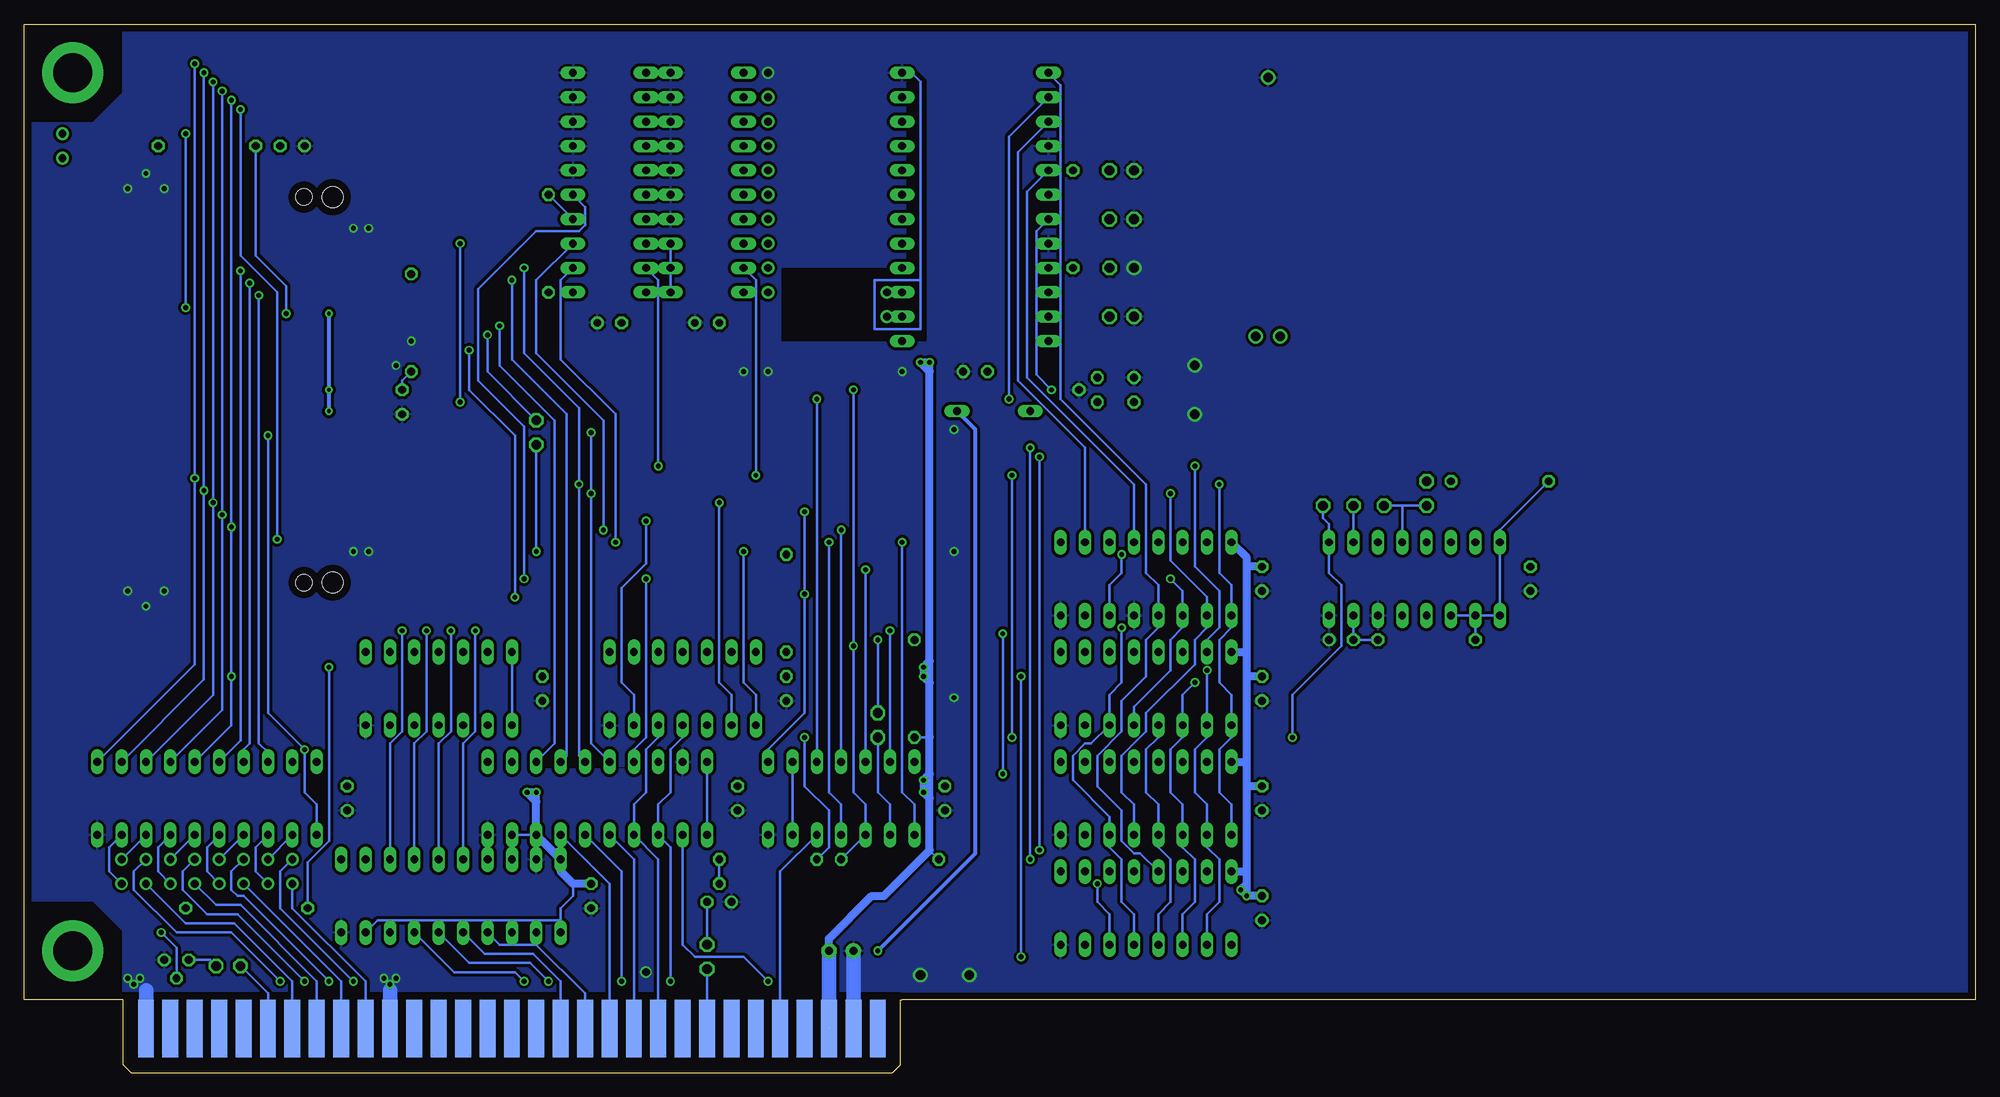
[diagram p6: board, bottom side, seen from below]

Size 203.2 x 109.22 mm. Coordinates in mm from the lower left corner, seen from the top.
Outline: 111.76,7.62 0,7.62 0,109.22 203.2,109.22 203.2,7.62 193.04,7.62
Copper layers (1*16): Top 0.035mm / dielectric 1.5mm / Bottom 0.035mm
Design rules "JLCPCB Standard": minimum track width 5mil, minimum drill 0.3mm, track to track 5mil, track to pad 8mil, pad to pad 8mil, via to via 8mil, smd to smd 5mil, copper to edge 30mil, drill to drill 0.26mm, minimum pad ring 10mil, minimum via ring 8mil, stop-mask expansion 3mil, vias tented up to drill 25mil, thermal gap 10mil
tKeepout: area 109.2,76.2 to 124.5,83.8; area 0,107.6 to 203.2,109.2
bKeepout: area 109.2,76.2 to 124.5,83.8; area 0,107.6 to 203.2,109.2
tRestrict: area 193,99.1 to 203.2,109.2; area 111.9,0 to 192.9,8.4; area 192.9,7.6 to 203.2,17.8; 9 lines
bRestrict: area 192.9,7.6 to 203.2,17.8; area 193,99.1 to 203.2,109.2; area 111.9,0 to 192.9,8.4; 1 lines

### Footprints (pad centres in the part's own frame; a part is rotated, then mirrored left to right if it is on the bottom)
BU2032 = drill 1: N 13.462,0; P1 -13.462,1.27; P2 -13.462,-1.27
C025-024X044 = drill 0.813 octagon: 1 -1.27,0; 2 1.27,0
E2,5-6 = drill 0.813 pad 1.6 octagon: + -1.27,0 | drill 0.813 pad 1.6: - 1.27,0
CF-KYOCERA = smd 0.4 x 4.5: 1 -15.557,43.985; 2 -14.287,43.985; 3 -13.018,43.985; 4 -11.748,43.985; 5 -10.477,43.985; 6 -9.207,43.985; 7 -7.938,43.985; 8 -6.668,43.985; 9 -5.397,43.985; 10 -4.128,43.985; 11 -2.857,43.985; 12 -1.587,43.985; 13 -0.318,43.985; 14 0.953,43.985; 15 2.223,43.985; 16 3.493,43.985; 17 4.763,43.985; 18 6.032,43.985; 19 7.303,43.985; 20 8.572,43.985; 21 9.842,43.985; 22 11.113,43.985; 23 12.383,43.985; 24 13.652,43.985; 25 14.922,43.985; 26 -14.922,43.985; 27 -13.652,43.985; 28 -12.383,43.985; 29 -11.113,43.985; 30 -9.842,43.985; 31 -8.572,43.985; 32 -7.303,43.985; 33 -6.032,43.985; 34 -4.763,43.985; 35 -3.493,43.985; 36 -2.223,43.985; 37 -0.953,43.985; 38 0.318,43.985; 39 1.587,43.985; 40 2.857,43.985; 41 4.128,43.985; 42 5.397,43.985; 43 6.668,43.985; 44 7.938,43.985; 45 9.207,43.985; 46 10.477,43.985; 47 11.748,43.985; 48 13.018,43.985; 49 14.287,43.985; 50 15.557,43.985 | smd 3 x 5.4: M1 -21.71,21.535; M2 21.71,21.535 | hole 2.2: -20.08,41.035; 20.08,41.035 | hole 1.7: -20.08,38.035; 20.08,38.035
LED-3R = drill 0.813: A 1.27,-4; C -1.27,-4
DO35-7 = drill 0.813 long: A 3.81,0; C -3.81,0
1X2 = drill 1.016 octagon: 1 -1.27,0; 2 1.27,0
EDGE62M = smd 1.651 x 5.969: 1 -38.1,-3.01; 3 -35.56,-3.01; 5 -33.02,-3.01; 7 -30.48,-3.01; 9 -27.94,-3.01; 11 -25.4,-3.01; 13 -22.86,-3.01; 15 -20.32,-3.01; 17 -17.78,-3.01; 19 -15.24,-3.01; 21 -12.7,-3.01; 23 -10.16,-3.01; 25 -7.62,-3.01; 27 -5.08,-3.01; 29 -2.54,-3.01; 31 0,-3.01; 33 2.54,-3.01; 35 5.08,-3.01; 37 7.62,-3.01; 39 10.16,-3.01; 41 12.7,-3.01; 43 15.24,-3.01; 45 17.78,-3.01; 47 20.32,-3.01; 49 22.86,-3.01; 51 25.4,-3.01; 53 27.94,-3.01; 55 30.48,-3.01; 57 33.02,-3.01; 59 35.56,-3.01; 61 38.1,-3.01 | smd 1.651 x 5.969 bottom: 2 -38.1,-3.01; 4 -35.56,-3.01; 6 -33.02,-3.01; 8 -30.48,-3.01; 10 -27.94,-3.01; 12 -25.4,-3.01; 14 -22.86,-3.01; 16 -20.32,-3.01; 18 -17.78,-3.01; 20 -15.24,-3.01; 22 -12.7,-3.01; 24 -10.16,-3.01; 26 -7.62,-3.01; 28 -5.08,-3.01; 30 -2.54,-3.01; 32 0,-3.01; 34 2.54,-3.01; 36 5.08,-3.01; 38 7.62,-3.01; 40 10.16,-3.01; 42 12.7,-3.01; 44 15.24,-3.01; 46 17.78,-3.01; 48 20.32,-3.01; 50 22.86,-3.01; 52 25.4,-3.01; 54 27.94,-3.01; 56 30.48,-3.01; 58 33.02,-3.01; 60 35.56,-3.01; 62 38.1,-3.01
TO92 = drill 0.813 octagon: 1 -1.27,0; 2 0,1.905; 3 1.27,0
0207/10 = drill 0.813 octagon: 1 -5.08,0; 2 5.08,0
0207/12 = drill 0.813 octagon: 1 -6.35,0; 2 6.35,0
SIL8 = drill 0.813: 1 -8.89,0; 2 -6.35,0; 3 -3.81,0; 4 -1.27,0; 5 1.27,0; 6 3.81,0; 7 6.35,0; 8 8.89,0
SIL9 = drill 0.813: 1 -10.16,0; 2 -7.62,0; 3 -5.08,0; 4 -2.54,0; 5 0,0; 6 2.54,0; 7 5.08,0; 8 7.62,0; 9 10.16,0
TP-040 = drill 1 octagon: 1 0,0
DIL16 = drill 0.813 long: 1 -8.89,-3.81; 2 -6.35,-3.81; 3 -3.81,-3.81; 4 -1.27,-3.81; 5 1.27,-3.81; 6 3.81,-3.81; 7 6.35,-3.81; 8 8.89,-3.81; 9 8.89,3.81; 10 6.35,3.81; 11 3.81,3.81; 12 1.27,3.81; 13 -1.27,3.81; 14 -3.81,3.81; 15 -6.35,3.81; 16 -8.89,3.81
DIL20 = drill 0.813 long: 1 -11.43,-3.81; 2 -8.89,-3.81; 3 -6.35,-3.81; 4 -3.81,-3.81; 5 -1.27,-3.81; 6 1.27,-3.81; 7 3.81,-3.81; 8 6.35,-3.81; 9 8.89,-3.81; 10 11.43,-3.81; 11 11.43,3.81; 12 8.89,3.81; 13 6.35,3.81; 14 3.81,3.81; 15 1.27,3.81; 16 -1.27,3.81; 17 -3.81,3.81; 18 -6.35,3.81; 19 -8.89,3.81; 20 -11.43,3.81
DIL14 = drill 0.813 long: 1 -7.62,-3.81; 2 -5.08,-3.81; 3 -2.54,-3.81; 4 0,-3.81; 5 2.54,-3.81; 6 5.08,-3.81; 7 7.62,-3.81; 8 7.62,3.81; 9 5.08,3.81; 10 2.54,3.81; 11 0,3.81; 12 -2.54,3.81; 13 -5.08,3.81; 14 -7.62,3.81
DIL24 = drill 0.813 long: 1 -13.97,-7.62; 2 -11.43,-7.62; 3 -8.89,-7.62; 4 -6.35,-7.62; 5 -3.81,-7.62; 6 -1.27,-7.62; 7 1.27,-7.62; 8 3.81,-7.62; 9 6.35,-7.62; 10 8.89,-7.62; 11 11.43,-7.62; 12 13.97,-7.62; 13 13.97,7.62; 14 11.43,7.62; 15 8.89,7.62; 16 6.35,7.62; 17 3.81,7.62; 18 1.27,7.62; 19 -1.27,7.62; 20 -3.81,7.62; 21 -6.35,7.62; 22 -8.89,7.62; 23 -11.43,7.62; 24 -13.97,7.62
CRYSTAL-3X8N = drill 0.813: 1 -1.27,0; 2 1.27,0

### Placement (x,y rotation side)
BT1  73.66,90.17 90 top
C1  46.35,51.43 270 top
C2  74.3,17.14 270 top
C3  74.3,28.57 270 top
C4  74.3,40 270 top
C5  74.3,51.43 270 top
C6  144.15,18.41 270 top
C7  107.31,28.57 270 top
C8  128.91,28.57 270 top
C9  169.54,28.57 270 top
C10  123.83,40 270 top
C11  149.22,40 270 top
C12  104.14,73.03 0 top
C13  132.08,78.11 0 top
C14  142.24,78.11 0 top
C15  163.83,69.85 270 top
C16  66.04,45.09 0 top
C17  118.11,12.7 180 top
C18  175.26,96.52 180 top
C19  87.63,71.12 90 top
CF1  212.09,71.12 90 top
D1  203.2,96.52 270 top
D2  102.23,68.9 0 top
J1  88.9,78.74 180 top
J2  88.9,93.98 180 top
JP1  57.15,60.32 90 top
JP2  114.3,36.2 90 top
JP3  132.08,12.07 270 top
JP4  181.93,11.11 180 top
JP5  88.9,88.9 180 top
JP6  149.86,66.67 270 top
P1  152.4,7.62 0 top
Q1  130.81,17.78 0 top
Q2  187.32,11.75 180 top
R1  57.15,45.09 180 top
R2  49.53,61.59 180 top
R3  113.03,22.23 0 top
R4  125.73,22.23 0 top
R5  110.49,40 270 top
R6  123.83,48.89 270 top
R7  180.02,17.14 0 top
R8  184.15,96.52 180 top
R9  93.98,88.9 270 top
R10  148.59,86.36 90 top
R11  162.88,78.11 270 top
RN1  184.15,19.68 0 top
RN2  184.15,22.23 0 top
RN3  125.73,91.44 90 top
TP1  90.17,83.82 0 top
TP4  67.94,59.05 0 top
TP5  61.59,59.05 0 top
TP6  64.77,59.05 0 top
U1  58.42,51.43 0 top
U2  86.36,17.14 0 top
U3  86.36,28.57 0 top
U4  86.36,40 0 top
U5  86.36,51.43 0 top
U6  158.75,18.41 0 top
U7  118.11,28.57 0 top
U8  143.51,28.57 0 top
U9  184.15,28.57 0 top
U10  134.62,40 0 top
U11  160.02,40 0 top
U12  104.14,90.17 90 top
U13  132.08,92.71 90 top
U14  142.24,92.71 90 top
U15  91.44,71.12 270 top
Y1  113.35,80.01 270 top

### Tracks (layer width: path | path; a pad name or v marks a point on that pad's centre or on a via)
0V  (via drill 0.5, 0.8, 0.81 pad 1.27, 1, 1.02)  (1 unrouted)
  Top 0.254: U12.12 110.81,104.14 109.86,103.19 109.86,82.55 | 109.86,82.55 109.86,77.47 114.62,77.47 114.62,82.55 109.86,82.55
  Top 0.381: 170.81,75.88 CF1.17 165.42,75.88 | 170.81,74.61 CF1.16 165.42,74.61 | 170.81,73.34 CF1.15 165.42,73.34 | 170.81,72.07 CF1.14 165.42,72.07 | 170.81,72.71 CF1.39 165.42,72.71 | 170.81,69.53 CF1.12 165.42,69.53 | 170.81,68.26 CF1.11 165.42,68.26 | CF1.10 170.81,66.99 | 170.81,65.72 CF1.9 165.42,65.72 | 170.81,64.45 CF1.8 165.42,64.45 | CF1.1 170.81,55.56 | CF1.50 170.81,86.68 | CF1.1 165.42,55.56 | CF1.50 165.42,86.68 | CF1.1 168.1,54.93 | CF1.50 168.1,87.31
  Top 1.524: P1.21 139.7,8.57
  Bottom 0.254: U12.12 110.81,104.14 109.86,103.19 109.86,82.55 | 109.86,82.55 109.86,77.47 114.62,77.47 114.62,82.55 109.86,82.55
  Bottom 1.524: P1.4 C17.- | P1.42 165.1,8.57 | P1.62 190.5,8.57
  other vias: 87.63,83.82 164.47,9.84 165.1,9.21 165.74,9.84 191.13,9.84 191.77,9.21 192.41,9.84 188.59,50.16 192.41,50.16 190.5,48.58 192.41,92.08 188.59,92.08 190.5,93.66 162.88,76.2 164.47,73.66 138.43,10.48 167.32,54.29 168.91,54.29 168.91,87.95 167.32,87.95 109.86,10.16 104.78,10.16 81.28,73.66 81.28,68.58 106.36,54.29 106.36,39.05 106.36,66.99 111.76,73.03 125.73,73.03 128.27,73.03 125.73,104.14
  pour Bottom (rank 3): 0,109.22 203.2,109.22 203.2,7.62 0,7.62
  pour Top (rank 3): 0,109.22 203.2,109.22 203.2,7.62 0,7.62
0V-CUTOUT-POLYGON
  cutout Top: 111.28,104.62 110.49,104.62 109.22,103.35 109.22,76.2 124.3,76.2 124.3,83.82 111.28,83.82
  cutout Bottom: 111.28,104.62 110.49,104.62 109.22,103.35 109.22,76.2 124.3,76.2 124.3,83.82 111.28,83.82
!BCSX  (via drill 0.5)
  Top 0.254: P1.9 124.46,8.26 v125.73,9.53
  Bottom 0.254: v125.73,9.53 128.27,12.07 133.35,12.07 134.62,13.34 U8.2
!BIRQX
  Bottom 0.254: P1.52 177.8,8.26 JP4.2
!BRD  (via drill 0.5)
  Top 0.254: P1.19 137.16,8.26 v135.89,9.53
  Bottom 0.254: v135.89,9.53 135.89,23.5 U8.3 137.16,27.94 135.89,29.21 135.89,33.66 134.62,34.92 U10.4
!BRST
  Bottom 0.254: P1.10 124.46,20.96 U7.5
!BWAIT
  Bottom 0.254: P1.16 JP3.2
!BWR
  Bottom 0.254: P1.20 137.16,22.23 U8.4 139.7,27.94 138.43,29.21 138.43,33.66 137.16,34.92 U10.5
!CF_CD  (via drill 0.5)
  Top 0.254: CF1.26 176.21,56.2 v176.85,55.56 | v180.66,100.33 157.48,100.33 R10.2
  Bottom 0.254: v176.85,55.56 176.85,81.28 180.66,85.09 v180.66,100.33 | R10.2 U14.4
!CS_CF0  (via drill 0.5)
  Top 0.254: CF1.7 138.75,63.18 137.79,64.14 v97.47,64.14 | U2.15 82.23,23.18 v97.47,23.18
  Bottom 0.254: v97.47,23.18 v97.47,64.14
!CS_CF1  (via drill 0.5)
  Top 0.254: CF1.32 139.38,63.82 138.11,65.09 v98.42,65.09 | U2.14 83.82,22.23 v98.42,22.23
  Bottom 0.254: v98.42,65.09 v98.42,22.23
!CS_ID  (via drill 0.5)
  Top 0.254: v127,62.23 v100.33,62.23 | v100.33,34.92 93.98,34.92 U4.7
  Bottom 0.254: U13.19 127,82.55 v127,62.23 | v100.33,62.23 v100.33,34.92
!CS_IER  (via drill 0.5)
  Top 0.254: v101.28,45.72 103.82,48.26 133.35,48.26 133.99,47.62 158.43,47.62 160.02,46.04 U11.11 | U3.15 81.28,31.12 v101.28,31.12
  Bottom 0.254: v101.28,31.12 v101.28,45.72
!CS_RTC
  Bottom 0.254: U2.13 87,22.86 87.63,22.86 88.9,24.13 88.9,27.3 91.44,29.85 91.44,33.02 88.9,35.56 88.9,38.73 86.36,41.27 86.36,45.09 85.09,46.35 U5.4 85.09,50.8 86.36,52.07 86.36,61.28 95.25,70.17 95.25,102.87 U12.13
!CS_SR  (via drill 0.5)
  Top 0.254: v137.16,63.18 v81.28,63.18
  Bottom 0.254: U14.19 137.16,82.55 v137.16,63.18 | v81.28,63.18 81.28,52.7 78.74,50.16 78.74,46.35 80.01,45.09 U4.15
!CSX  (via drill 0.5)
  Top 0.254: U8.18 137.16,33.66 | 137.16,33.66 139.7,33.66 140.65,34.61 174.31,34.61 175.26,33.66 U9.19 | v71.12,34.92 85.09,34.92 | U4.4 85.09,34.92 | 85.09,34.92 93.03,34.92 93.66,34.29 99.38,34.29 100.01,33.66 137.16,33.66
  Bottom 0.254: U2.4 85.09,16.51 83.82,17.78 83.82,22.23 85.09,23.5 U3.4 85.09,27.94 86.36,29.21 86.36,33.66 85.09,34.92 U4.4 | TP4.1 67.94,57.78 67.31,57.15 U1.9 67.31,52.07 66.04,50.8 66.04,44.45 71.12,39.37 v71.12,34.92
!INT_RTC  (via drill 0.5)
  Top 0.254: v96.2,71.12 v116.84,71.12 | v116.84,44.45 117.47,45.09 128.27,45.09 U10.13
  Bottom 0.254: v116.84,71.12 v116.84,44.45 116.84,29.21 115.57,27.94 U7.3 R3.2 | U12.19 97.79,87.63 97.79,72.71 v96.2,71.12
!RD  (via drill 0.5)
  Top 0.254: U8.17 140.97,33.66 v173.99,33.66 | v177.8,66.36 CF1.34 | v138.43,51.43 v83.82,51.43
  Bottom 0.254: U9.1 172.72,27.94 173.99,29.21 v173.99,33.66 177.8,37.46 v177.8,66.36 | U4.5 87.63,38.1 83.82,41.91 83.82,45.09 82.55,46.35 U5.3 82.55,50.16 v83.82,51.43 | U8.17 139.7,33.66 138.43,34.92 v138.43,51.43
!RST  (via drill 0.5)
  Top 0.254: U11.10 162.56,46.04 159.07,49.53 v152.08,49.53 123.19,49.53 122.87,49.85 v121.92,49.85 | v156.84,75.25 CF1.41 | v121.92,58.42 70.17,58.42 69.22,57.47 64.45,57.47 U1.11
  Bottom 0.254: U7.8 125.73,33.66 121.92,37.46 v121.92,49.85 v121.92,58.42 | v152.08,49.53 152.08,66.36 156.84,71.12 v156.84,75.25
!WAIT_CF  (via drill 0.5)
  Top 0.254: CF1.42 165.1,76.52 164.47,77.15 156.21,77.15 155.89,76.84 v154.94,76.84
  Bottom 0.254: v154.94,76.84 154.94,73.03 JP6.1
!WAIT_CSX
  Bottom 0.254: U1.12 59.69,59.05 | JP1.1 59.69,59.05 | 59.69,59.05 TP5.1
!WR  (via drill 0.5)
  Top 0.254: CF1.35 165.42,67.63 164.47,66.67 v144.15,66.67 | v144.15,60.32 v83.82,60.32
  Bottom 0.254: U8.16 144.15,34.29 v144.15,60.32 v144.15,66.67 | U3.5 87.63,27.94 88.9,29.21 88.9,33.02 86.36,35.56 86.36,37.46 81.28,42.54 81.28,45.09 80.01,46.35 U5.2 80.01,49.53 83.82,53.34 v83.82,60.32
+5V  (via drill 0.4, 0.5)  (1 unrouted)
  Top 0.254: U11.2 154.94,37.46 | 154.94,37.46 157.48,37.46 | 157.48,37.46 158.75,37.46 U11.4 | U11.3 157.48,37.46 | 154.94,37.46 153.67,37.46 U11.1 | U13.1 135.89,79.69 | R10.1 148.59,79.69 | U11.14 U11.13 | R6.2 U10.14 | v88.9,53.97 78.74,53.97 U5.16 | v91.44,19.68 91.44,18.41 | v175.9,79.06 v171.45,79.06 | U14.1 146.05,79.69
  Top 0.381: CF1.36 v171.45,68.9 | CF1.44 v171.45,79.06 | 170.81,71.12 170.5,70.8 CF1.13 165.42,70.8 165.1,71.12 165.42,71.44 CF1.38 170.5,71.44 170.81,71.12 | v171.45,71.12 170.81,71.12
  Top 0.813: 110.17,29.85 C8.1 132.08,29.85 | 132.08,29.85 149.86,29.85 | 150.81,29.85 C9.1 171.45,29.85 172.72,31.12 U9.20 | U8.20 132.08,29.85 | 149.86,29.53 149.86,29.85 | 165.1,71.12 C15.1 157.16,71.12 148.59,79.69 146.05,79.69 140.97,79.69 | 127,41.27 C10.1 110.49,41.27 | 127,41.27 133.35,41.27 133.99,40.64 140.97,40.64 141.6,41.27 C11.1 151.13,41.27 152.4,42.54 U11.14 | U10.14 127,41.27 | 110.49,74.61 123.83,74.61 125.73,76.52 125.73,79.69 | 125.73,79.69 128.27,79.69 | 130.81,79.69 135.89,79.69 138.43,79.69 | U13.20 128.27,79.69 | RN3.1 125.73,79.69 | C13.1 130.81,79.69 | 130.81,79.69 128.27,79.69 | U14.20 138.43,79.69 | 138.43,79.69 140.97,79.69 | C14.1 140.97,79.69 | 110.17,29.85 108.9,29.85 | 108.9,29.85 C7.1 | 110.49,41.27 v109.54,41.27 v109.54,42.23 110.49,41.27 | C1.1 49.53,52.7 | 49.53,52.7 C5.1 | U1.16 49.53,52.7 | 77.15,18.41 91.44,18.41 114.94,18.41 119.38,13.97 C17.+ | 150.81,29.85 v150.81,29.21 v149.86,29.21 | 150.81,29.85 149.86,29.85 | 77.15,18.41 v76.52,19.05 v75.88,18.41 77.15,18.41 | v109.54,30.48 110.17,29.85 | 110.17,29.85 v109.54,29.21 108.9,29.85 | 108.9,29.85 v109.54,30.48 | U7.14 109.54,31.43 v109.54,30.48 | 110.49,74.61 v109.86,73.98 v108.9,73.98 109.54,74.61 110.49,74.61 | C18.1 R8.2
  Top 0.914: v149.86,29.21 149.86,29.53
  Bottom 0.254: U6.8 165.1,15.88 | 165.1,15.88 152.4,15.88 | 152.4,15.88 149.86,15.88 | 149.86,15.88 147.32,15.88 | U6.3 152.4,15.88 | U6.2 149.86,15.88 | U6.1 147.32,15.88 | U6.9 166.37,15.88 165.1,15.88 | U8.1 U8.20 | U8.8 U8.9 | 147.32,15.88 147.32,17.14 146.05,18.41 146.05,19.68 | R11.2 163.83,72.07 C15.1 | U11.1 U11.14 | U13.1 U13.2 U13.3 | R3.1 108.9,23.18 | R5.2 108.9,34.92 | U1.3 U1.2 | U1.2 U1.1 U1.16 49.53,56.52 R2.2 | R1.2 U1.2 | U5.6 90.17,50.8 88.9,52.07 v88.9,53.97 | U2.6 90.17,16.51 91.44,17.78 v91.44,19.68 | R8.2 179.07,85.09 175.9,81.92 v175.9,79.06
  Bottom 0.406: v171.45,68.9 v171.45,71.12 v171.45,79.06
  Bottom 0.813: C6.1 146.05,19.68 147.32,20.96 U6.20 U8.8 149.86,28.26 | 149.86,28.26 v149.86,29.21 v150.81,29.21 149.86,28.26 | C17.+ 119.38,13.97 114.94,18.41 113.67,18.41 108.9,23.18 108.9,28.57 | 108.9,28.57 108.9,31.12 | 108.9,31.12 108.9,34.92 108.9,40.64 | 108.9,40.64 108.9,42.86 | 108.9,42.86 108.9,73.03 | 108.9,73.03 v108.9,73.98 v109.86,73.98 108.9,73.03 | C2.1 v75.88,18.41 | 75.88,19.68 75.88,20.96 | 75.88,20.96 75.88,29.85 | 75.88,29.85 75.88,32.38 | 75.88,32.38 75.88,41.27 | 75.88,41.27 75.88,43.81 | 75.88,43.81 75.88,52.7 | 75.88,52.7 75.88,53.66 U5.16 | C5.1 75.88,52.7 | C4.1 75.88,41.27 | U4.16 75.88,43.81 | U3.16 75.88,32.38 | C3.1 75.88,29.85 | U2.16 75.88,20.96 | 108.9,42.86 v109.54,42.23 v109.54,41.27 108.9,40.64 | v75.88,18.41 v76.52,19.05 75.88,19.68 | v75.88,18.41 75.88,19.68 | 108.9,31.12 v109.54,30.48 v109.54,29.21 108.9,28.57
  Bottom 1.524: P1.6 C17.+
+12V  (via drill 0.5)
  Top 0.406: P1.1 v114.3,12.7
  Bottom 0.406: v114.3,12.7 104.14,22.86 104.14,66.99 D2.A
A0  (via drill 0.5)
  Top 0.254: CF1.20 163.83,79.69 159.7,83.82 v151.13,83.82 | v145.41,61.28 v78.74,61.28
  Bottom 0.254: U3.1 77.47,27.94 78.74,29.21 78.74,33.66 77.47,34.92 U4.1 77.47,39.37 78.74,40.64 78.74,45.09 77.47,46.35 U5.1 77.47,50.8 78.74,52.07 v78.74,61.28 | v151.13,83.82 151.13,74.93 145.41,69.22 v145.41,61.28 145.41,33.02 U8.15
A1  (via drill 0.5)
  Top 0.254: CF1.19 164.15,78.42 160.02,82.55 v152.4,82.55
  Bottom 0.254: U8.14 146.69,33.02 146.69,68.58 152.4,74.3 v152.4,82.55
A2  (via drill 0.5)
  Top 0.254: CF1.18 165.42,77.15 164.78,77.79 v153.67,77.79
  Bottom 0.254: U8.13 147.96,34.29 147.96,67.95 153.67,73.66 v153.67,77.79
A4  (via drill 0.5)
  Top 0.254: v156.21,46.04 133.67,46.04 132.72,46.99 105.09,46.99 v99.38,41.27 | U2.1 78.74,12.07 v99.38,12.07
  Bottom 0.254: U6.16 157.48,34.29 156.21,35.56 v156.21,46.04 | v99.38,12.07 v99.38,41.27
A5  (via drill 0.5)
  Top 0.254: v161.29,46.04 159.07,48.26 134.3,48.26 133.67,48.89 103.19,48.89 96.2,41.91 v80.01,41.91
  Bottom 0.254: U6.14 162.56,34.29 161.29,35.56 v161.29,46.04 | U2.2 80.01,16.51 78.74,17.78 78.74,22.23 80.01,23.5 U3.2 80.01,27.94 81.28,29.21 81.28,33.66 80.01,34.92 U4.2 v80.01,41.91
A6  (via drill 0.5)
  Top 0.254: v158.75,46.04 157.8,46.99 133.67,46.99 133.03,47.62 104.46,47.62 97.47,40.64 v81.28,40.64
  Bottom 0.254: U6.15 160.02,34.29 158.75,35.56 v158.75,46.04 | U2.3 82.55,16.51 81.28,17.78 81.28,22.23 82.55,23.5 U3.3 82.55,27.94 83.82,29.21 83.82,33.66 82.55,34.92 U4.3 82.55,39.37 v81.28,40.64
A7  (via drill 0.5)
  Top 0.254: v163.83,46.04 159.38,50.48 123.51,50.48 123.19,50.8 121.28,50.8 120.97,50.48 103.82,50.48 99.69,46.35 v88.9,46.35
  Bottom 0.254: U6.13 165.1,34.29 163.83,35.56 v163.83,46.04 | U2.5 87.63,16.51 88.9,17.78 88.9,22.23 90.17,23.5 U3.6 90.17,26.67 93.98,30.48 93.98,33.02 92.71,34.29 92.08,34.29 U4.6 90.17,39.37 88.9,40.64 v88.9,46.35
BA0
  Bottom 0.254: P1.22 139.7,22.23 U8.5
BA1  (via drill 0.5)
  Top 0.254: P1.23 142.24,8.26 v140.97,9.53
  Bottom 0.254: v140.97,9.53 140.97,20.96 U8.6
BA2
  Bottom 0.254: P1.24 142.24,19.68 U8.7
BA4
  Bottom 0.254: P1.26 144.78,8.26 149.86,13.34 153.67,13.34 U6.4
BA5  (via drill 0.5)
  Top 0.254: P1.27 147.32,8.26 v148.59,9.53
  Bottom 0.254: v148.59,9.53 150.5,11.43 156.84,11.43 U6.6
BA6
  Bottom 0.254: P1.28 147.32,9.53 150.18,12.38 155.26,12.38 U6.5
BA7  (via drill 0.5)
  Top 0.254: P1.29 149.86,8.26 v151.13,9.53
  Bottom 0.254: v151.13,9.53 152.08,10.48 158.43,10.48 U6.7
BD0  (via drill 0.5)
  Top 0.254: P1.43 167.64,8.26 v168.91,9.53
  Bottom 0.254: v168.91,9.53 176.53,17.14 176.53,20.96 RN2.1
BD1
  Bottom 0.254: P1.44 167.64,9.53 175.26,17.14 RN1.1
BD2  (via drill 0.5)
  Top 0.254: P1.45 170.18,8.26 v171.45,9.53
  Bottom 0.254: v171.45,9.53 180.34,18.41 180.97,18.41 181.61,19.05 181.61,20.96 RN2.3
BD3
  Bottom 0.254: P1.46 170.18,9.53 RN1.3
BD4  (via drill 0.5)
  Top 0.254: P1.47 172.72,8.26 v173.99,9.53
  Bottom 0.254: v173.99,9.53 180.97,16.51 184.15,16.51 186.69,19.05 186.69,20.96 RN2.5
BD5
  Bottom 0.254: P1.48 172.72,9.53 180.66,17.46 183.2,17.46 RN1.5
BD6  (via drill 0.5)
  Top 0.254: P1.49 175.26,8.26 v176.53,9.53
  Bottom 0.254: v176.53,9.53 181.61,14.61 187.32,14.61 191.77,19.05 191.77,20.96 RN2.7
BD7
  Bottom 0.254: RN1.7 186.37,15.56 181.29,15.56 175.26,9.53 P1.50
CGND1  (via drill 4.06 pad 6.35)
  other vias: 198.12,12.7
CGND2  (via drill 4.06 pad 6.35)
  other vias: 198.12,104.14
D0  (via drill 0.5)
  Top 0.254: v178.75,80.96 CF1.21 163.51,80.96 159.38,85.09 142.88,85.09 141.6,86.36 U14.18 137.16,85.09 132.72,85.09 131.44,86.36 U13.18 RN3.2 124.46,85.09 113.03,85.09 U12.4
  Bottom 0.254: U9.18 177.8,33.34 178.75,34.29 v178.75,80.96
D1  (via drill 0.5)
  Top 0.254: v179.71,82.23 CF1.22 165.42,82.23 160.02,87.63 142.88,87.63 141.6,88.9 U14.17 137.16,87.63 132.72,87.63 131.44,88.9 U13.17 RN3.3 U12.5
  Bottom 0.254: U9.17 180.34,33.66 179.71,34.29 v179.71,82.23
D2  (via drill 0.5)
  Top 0.254: v180.66,83.5 CF1.23 165.42,83.5 158.75,90.17 142.88,90.17 141.6,91.44 U14.16 137.16,90.17 132.72,90.17 131.44,91.44 U13.16 RN3.4 U12.6
  Bottom 0.254: U9.16 180.66,34.61 v180.66,83.5
D3  (via drill 0.5)
  Top 0.254: CF1.2 v181.61,56.83 | U12.7 RN3.5 U13.15 131.44,93.98 132.72,92.71 137.16,92.71 U14.15 141.6,93.98 142.88,92.71 147.32,92.71 155.89,101.28 v181.61,101.28 | v181.61,41.27 170.81,41.27 170.18,41.91 158.12,41.91 157.48,42.54 U11.12
  Bottom 0.254: U9.15 181.61,36.2 v181.61,41.27 v181.61,56.83 v181.61,101.28
D4  (via drill 0.5)
  Top 0.254: CF1.3 v182.56,58.1 | U12.8 RN3.6 U13.14 131.44,96.52 132.72,95.25 137.16,95.25 U14.14 141.6,96.52 142.88,95.25 147.32,95.25 154.31,102.23 v182.56,102.23
  Bottom 0.254: U9.14 182.56,37.78 v182.56,58.1 v182.56,102.23
D5  (via drill 0.5)
  Top 0.254: CF1.4 v183.51,59.37 | U12.9 RN3.7 U13.13 131.44,99.06 132.72,97.79 137.16,97.79 U14.13 141.6,99.06 142.88,97.79 147.32,97.79 152.72,103.19 v183.51,103.19
  Bottom 0.254: U9.13 183.51,39.37 v183.51,59.37 v183.51,103.19
D6  (via drill 0.5)
  Top 0.254: CF1.5 v184.47,60.64 | U12.10 RN3.8 U13.12 131.44,101.6 132.72,100.33 137.16,100.33 U14.12 141.6,101.6 142.88,100.33 147.32,100.33 151.13,104.14 v184.47,104.14
  Bottom 0.254: U9.12 184.47,40.96 v184.47,60.64 v184.47,104.14
D7  (via drill 0.5)
  Top 0.254: CF1.6 v185.42,61.91 | U12.11 RN3.9 U13.11 131.44,104.14 132.72,102.87 137.16,102.87 U14.11 141.6,104.14 142.88,102.87 147.32,102.87 149.54,105.09 v185.42,105.09
  Bottom 0.254: U9.11 185.42,42.54 v185.42,61.91 v185.42,105.09
INT_CF  (via drill 0.5)
  Top 0.254: CF1.37 164.78,70.17 164.47,69.85 v157.8,69.85 | v157.8,86.36 U14.3 | v111.76,55.24 118.11,55.24 119.38,56.52 v142.88,56.52
  Bottom 0.254: v157.8,69.85 v157.8,86.36 | U7.1 110.49,27.94 111.76,29.21 v111.76,55.24 | v142.88,56.52 142.88,67.95 149.86,74.93 149.86,82.55 U14.3
INT_DISABLE  (via drill 0.5)
  Top 0.254: v151.13,51.43 159.7,51.43 165.1,46.04 U11.9
  Bottom 0.254: v151.13,51.43 151.13,67.31 155.89,72.07 155.89,81.6 149.86,87.63 145.41,87.63 144.78,88.27 144.78,90.17 U14.5
LOGO-C
  pour Top (no thermals): 16.9,108.39 16.74,107.71 13.74,107.71 13.26,105.83 16.24,105.83 16.07,105.14 12.78,105.14 arc-47 12.52,105.25 arc-36 12.38,105.57 arc-17 12.39,105.83 arc-5 12.41,105.98 12.82,107.56 arc-33 13.18,108.16 arc-31 13.56,108.38 arc-13 13.7,108.39
LOGO-I
  pour Top (no thermals): 11.52,108.39 12.4,108.39 11.55,105.14 10.68,105.14
LOGO-M
  pour Top (no thermals): 5.12,105.14 5.96,108.39 10.24,108.39 arc-50 10.58,108.27 arc-37 10.71,107.98 arc-17 10.68,107.6 10.04,105.14 9.16,105.14 9.83,107.71 8.69,107.71 8.03,105.14 7.14,105.14 7.81,107.71 6.67,107.71 6.01,105.14
LOGO-O
  pour Top (no thermals): 22.78,107.71 24.88,107.71 24.38,105.83 22.26,105.83 22.76,107.71 22.81,108.39 22.7,108.39 arc33 22.31,108.26 arc19 22.02,107.94 arc18 21.85,107.56 21.42,105.96 arc9 21.4,105.86 arc9 21.39,105.62 arc22 21.44,105.41 arc36 21.56,105.23 arc17 21.69,105.16 arc13 21.83,105.14 24.4,105.14 arc18 24.61,105.16 arc16 24.8,105.26 arc14 25.03,105.48 arc26 25.29,105.94 25.72,107.62 arc17 25.74,107.9 arc19 25.7,108.12 arc66 25.32,108.39 22.83,108.39
LOGO-R
  pour Top (no thermals): 17.55,108.39 18.25,107.71 18.08,107 20.19,107 20.36,107.71 18.28,107.71 17.58,108.39 20.71,108.39 arc-55 21.13,108.19 arc-31 21.24,107.93 arc-18 21.21,107.6 21.1,107.19 arc-18 21.02,107.01 arc-18 20.7,106.61 arc-19 20.39,106.41 arc-14 20.04,106.35 20.48,105.14 19.6,105.14 19.17,106.36 17.89,106.36 17.58,105.14 16.7,105.14
LOGO-X
  pour Top (no thermals): 0.83,105.14 1.81,105.14 2.92,106.17 3.49,105.14 4.53,105.14 3.59,106.77 5.37,108.39 4.38,108.39 3.26,107.36 2.69,108.39 1.66,108.39 2.59,106.74
N$1  (via drill 0.5)
  Top 0.254: CF1.45 177.48,80.33 178.12,79.69 v186.37,79.69 | v186.37,97.79 D1.C
  Bottom 0.254: v186.37,79.69 v186.37,97.79
N$2
  Top 0.254: R8.1 196.85,96.52 198.12,95.25 D1.A
N$3  (via drill 0.5)
  Top 0.254: U10.8 140.34,41.91 134.62,41.91 133.35,43.18 133.35,44.45 131.44,46.35 114.3,46.35 113.98,46.04 v113.03,46.04
  Bottom 0.254: U7.13 v113.03,46.04
N$4
  Top 0.254: U12.21 92.71,87.63 91.44,88.9 JP5.1
N$5
  Bottom 0.254: U7.2 113.03,27.94 114.3,29.21 JP2.1
N$6
  Bottom 0.254: Q1.2 R4.2
N$7
  Top 0.254: TP1.1 91.44,83.82 U12.23
N$8
  Top 0.254: U12.2 Y1.2
N$9
  Bottom 0.254: JP3.1 Q1.3
N$10
  Top 0.254: U12.3 Y1.1
N$11
  Bottom 0.254: U12.15 99.69,95.89 99.69,72.07 92.71,65.09 U5.10
N$12
  Bottom 0.254: U7.6 U7.9
N$13  (via drill 0.5)
  Top 0.254: v118.11,56.52 91.44,56.52 U5.11
  Bottom 0.254: U7.11 v118.11,56.52
N$14
  Bottom 0.254: U12.17 98.74,91.76 98.74,72.39 87.63,61.28 U5.12
N$15  (via drill 0.5)
  Top 0.254: v149.86,54.29 v128.27,54.29 125.73,54.29 125.41,53.97 R6.1
  Bottom 0.254: JP6.2 v149.86,54.29 | v128.27,54.29 128.27,40.64 127,39.37 U10.1
N$17
  Top 0.406: C12.1 99.69,76.2 U12.24 95.25,76.2 U15.1
N$18  (via drill 0.5)
  Top 0.254: v120.65,70.17 v100.65,70.17
  Bottom 0.254: U12.14 100.65,97.47 v100.65,70.17 | U7.10 v120.65,70.17
N$19
  Top 0.254: J1.1 91.44,78.74 92.71,77.47 103.5,77.47 104.78,76.2 U12.1
N$20
  Top 0.254: J2.1 R9.1 U12.18
N$21
  Top 0.406: D2.C 92.39,68.9 U15.3 C19.1
N$22  (via drill 0.5)
  Top 0.254: v188.91,14.61 R7.2
  Bottom 0.254: Q2.2 187.32,13.02 v188.91,14.61
N$23
  Bottom 0.254: JP4.1 183.83,11.75 Q2.3
N$24
  Top 0.254: U12.22 R9.2 91.44,86.36 86.36,86.36 76.71,76.71 BT1.P2 BT1.P1
N$25
  Top 0.254: R11.1 164.47,81.6 CF1.46
N$26
  Top 0.254: U11.8 166.37,42.54 159.38,42.54 158.75,43.18 158.75,44.45 158.12,45.09 138.43,45.09 U10.10
N$29
  Bottom 0.254: U1.7 C16.1 R1.1
N$30  (via drill 0.5)
  Top 0.254: R2.1 JP1.2 67.94,61.59 70.17,59.37 v130.81,59.37
  Bottom 0.254: U10.2 129.54,39.37 130.81,40.64 v130.81,59.37
N$34
  Top 0.254: U10.11 135.89,42.54 138.43,42.54 U10.9
N$36  (via drill 0.5)
  Top 0.254: U10.12 130.18,45.72 114.94,45.72 v114.3,45.09 R5.1
  Bottom 0.254: JP2.2 v114.3,45.09
N$37
  Bottom 0.254: RN2.2 U9.2
N$38
  Bottom 0.254: RN1.2 179.07,20.96 179.07,23.5 U9.3
N$39
  Bottom 0.254: U9.4 RN2.4
N$40
  Bottom 0.254: U9.5 184.15,23.5 184.15,20.96 RN1.4
N$41
  Bottom 0.254: U9.6 RN2.6
N$42
  Bottom 0.254: U9.7 189.23,23.5 189.23,20.96 RN1.6
N$43
  Bottom 0.254: U9.8 RN2.8
N$44
  Bottom 0.254: U9.9 194.31,23.5 194.31,20.96 RN1.8
N$46  (via drill 0.5)
  Top 0.254: v121.92,34.92 130.81,34.92 U10.3
  Bottom 0.254: R4.1 119.38,23.5 119.38,27.3 121.92,29.85 v121.92,34.92
N$47  (via drill 0.5)
  Top 0.254: v115.57,52.39 121.28,52.39 121.6,52.07 126.05,52.07 126.36,52.39 161.29,52.39 v171.45,42.23
  Bottom 0.254: U7.12 v115.57,52.39 | R7.1 173.67,21.91 171.45,24.13 v171.45,42.23
RWCYCLE  (via drill 0.5)
  Top 0.254: U1.10 66.04,56.52 69.53,56.52 70.48,57.47 v138.43,57.47
  Bottom 0.254: U1.10 TP6.1 | U10.6 139.7,39.37 140.97,40.64 140.97,50.48 138.43,53.02 v138.43,57.47
SR_RTC  (via drill 0.5)
  Top 0.254: v119.38,55.24 v141.6,55.24
  Bottom 0.254: U7.4 118.11,27.94 119.38,29.21 v119.38,55.24 | v141.6,55.24 141.6,68.58 147.32,74.3 147.32,82.55 U14.2

### Text on the board
tPlace: + | KICKSTART | CLEAR | + | POWER / ON | CF WAIT | CSX WAIT | CF INT | WAIT | IRQ
tNames: XMICRO-CF | V1.0 2414 | JLCJLCJLCJLC | CHRIS WEIR / ID $03
tValues: 6pF | 12.5pF